# Altium schematic sheet SystemLevelDiagram.SchDoc
size E
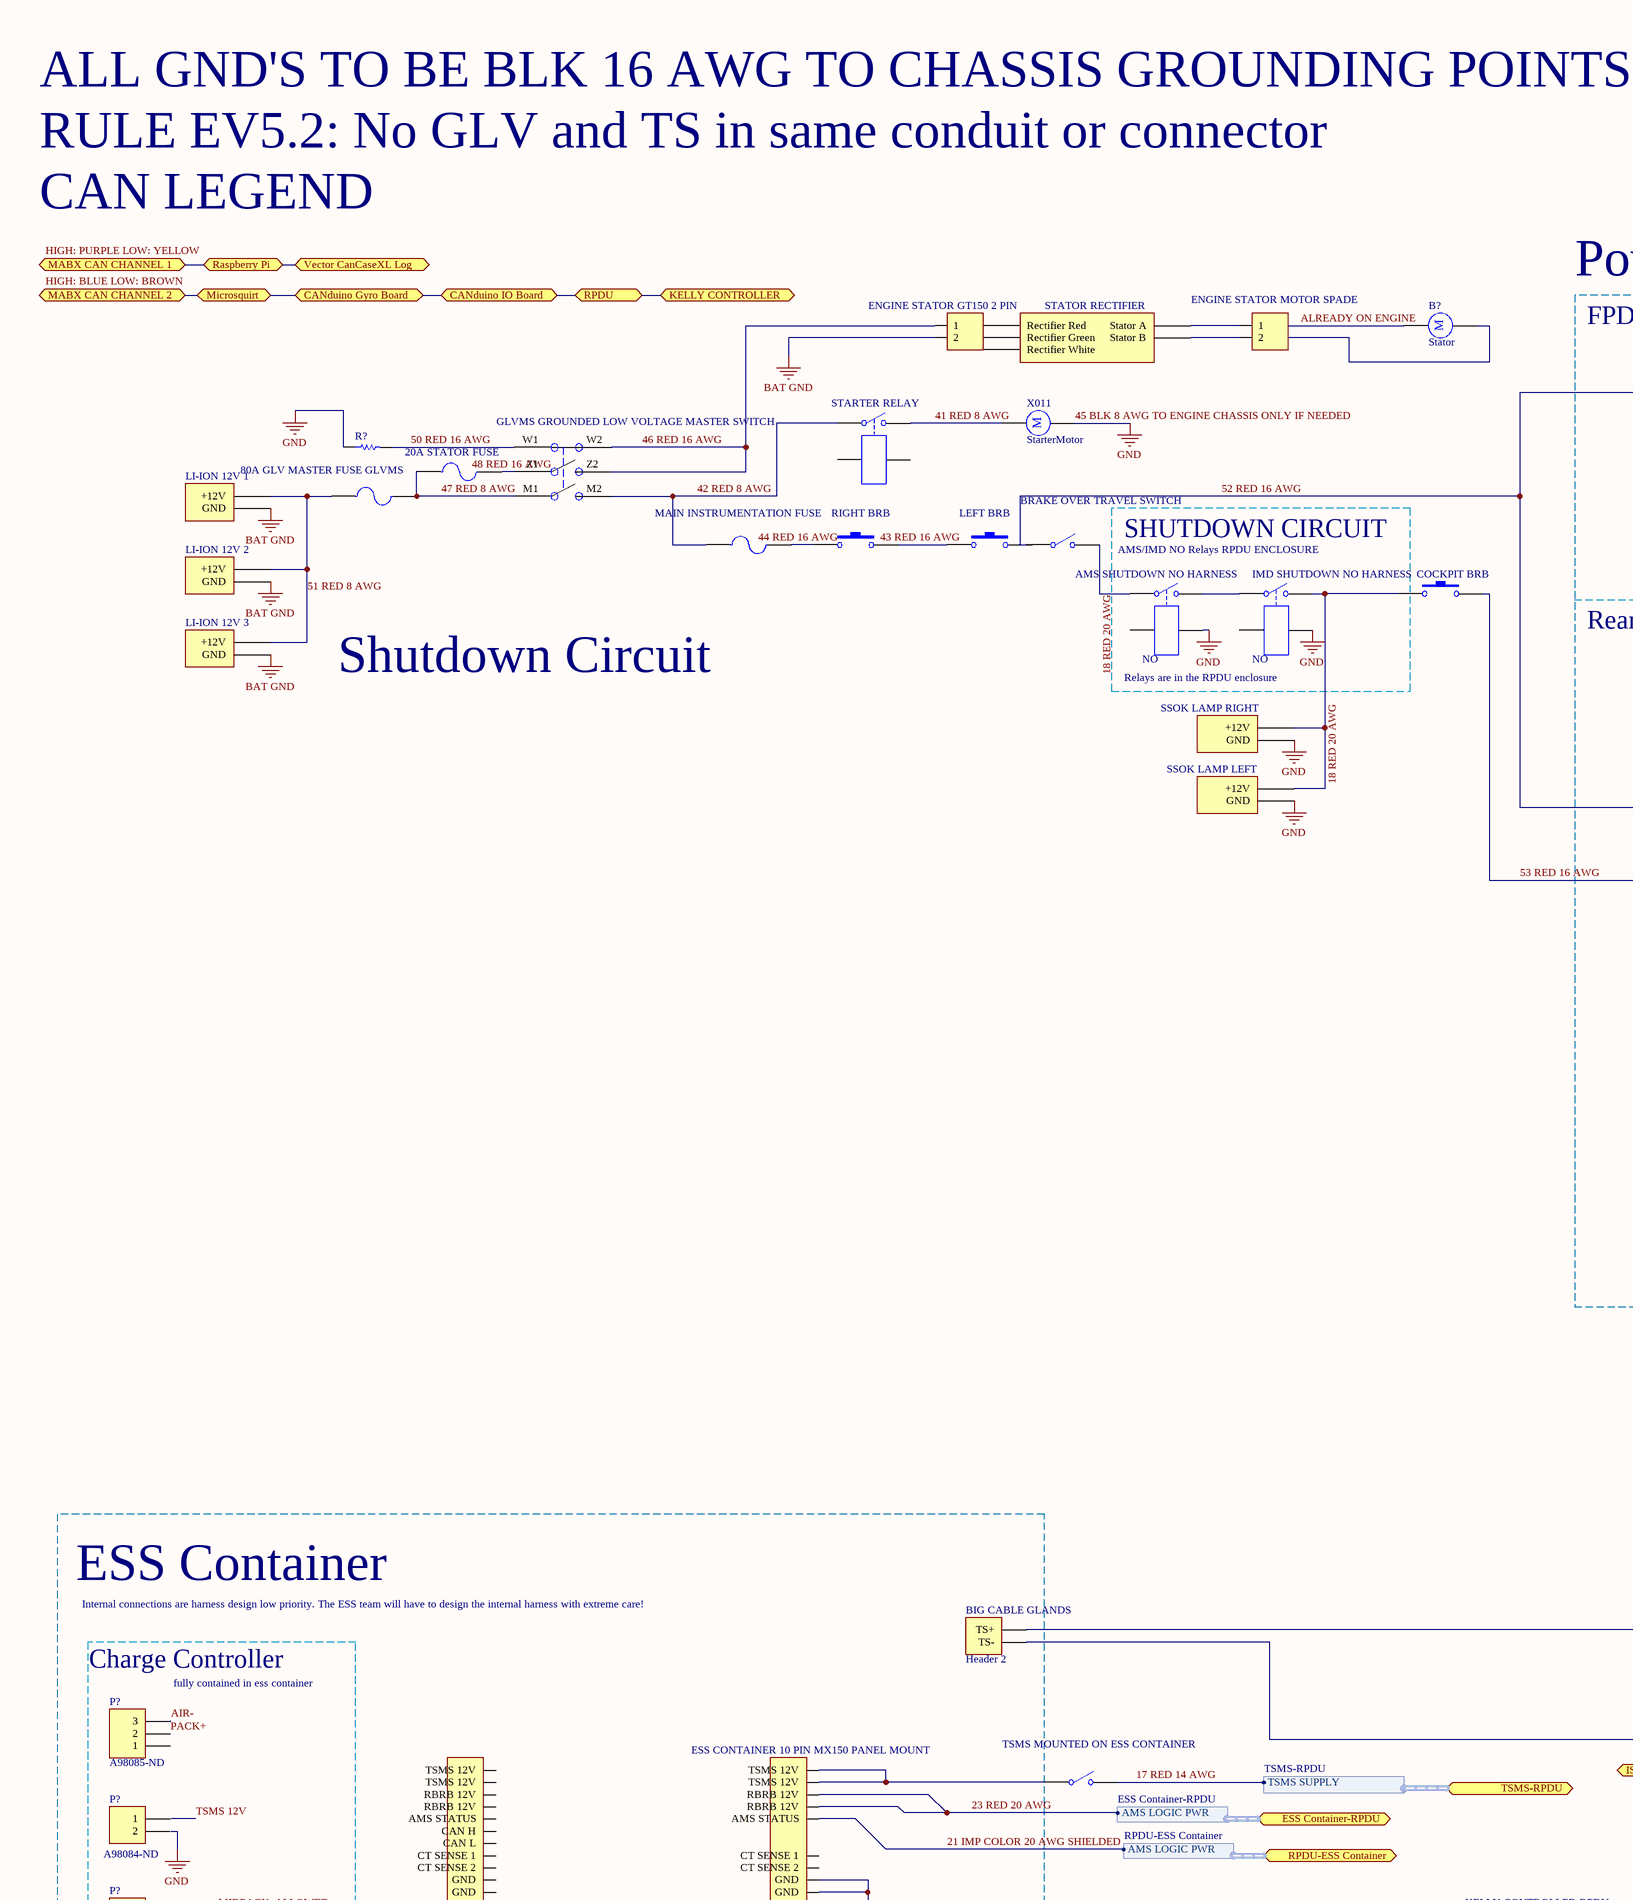
[diagram p0: SystemLevelDiagram.SchDoc, top left]
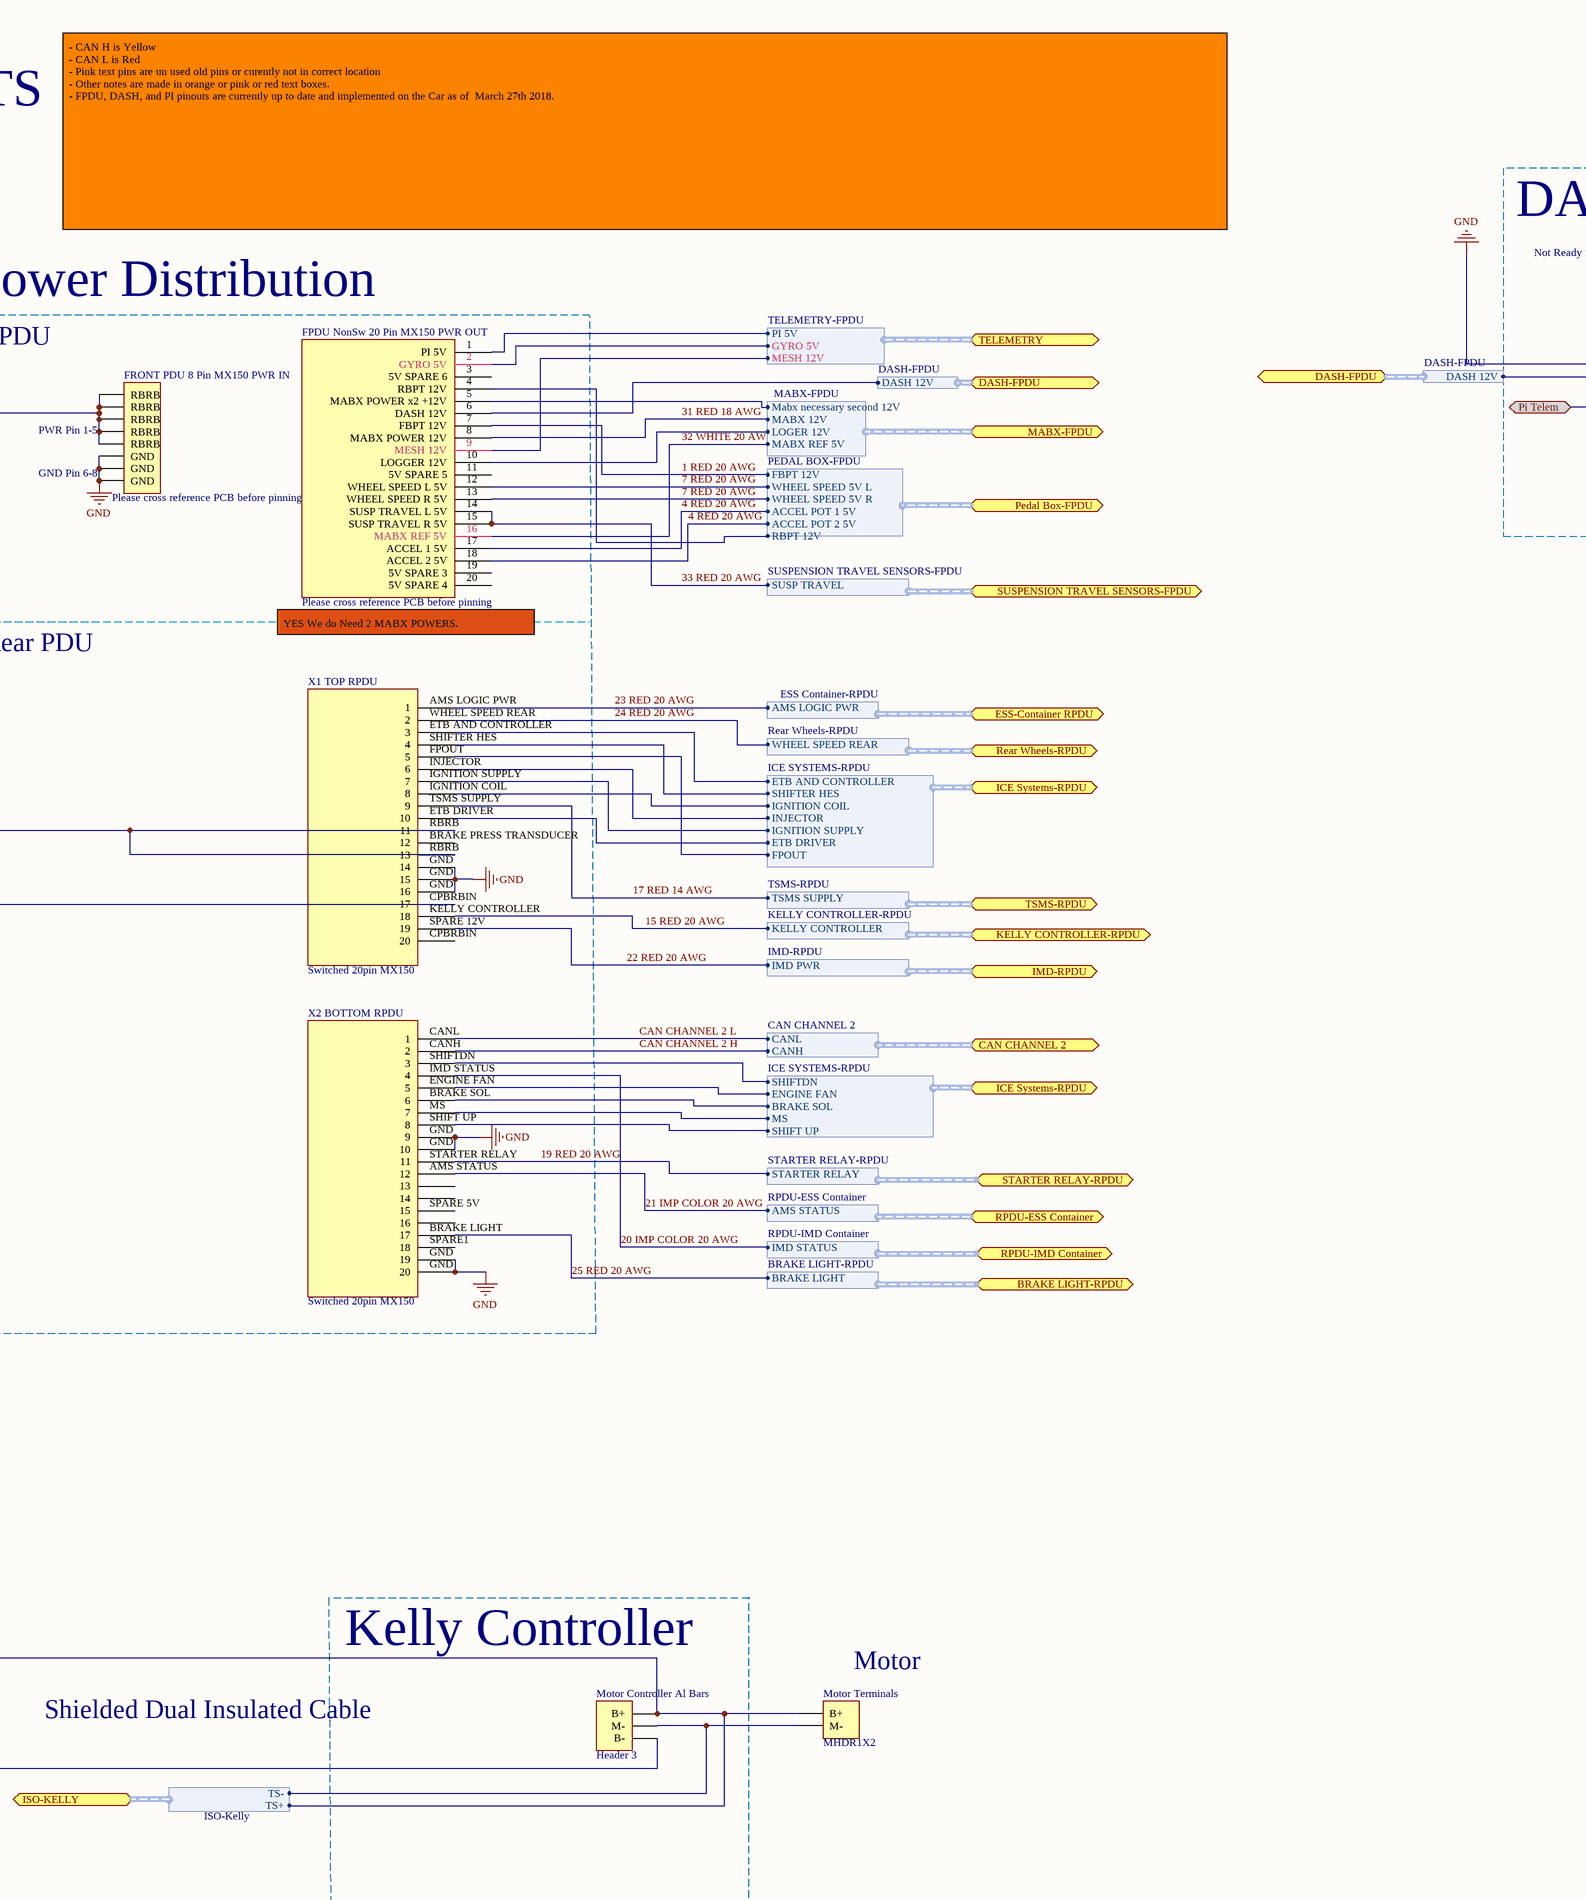
[diagram p1: SystemLevelDiagram.SchDoc, top middle]
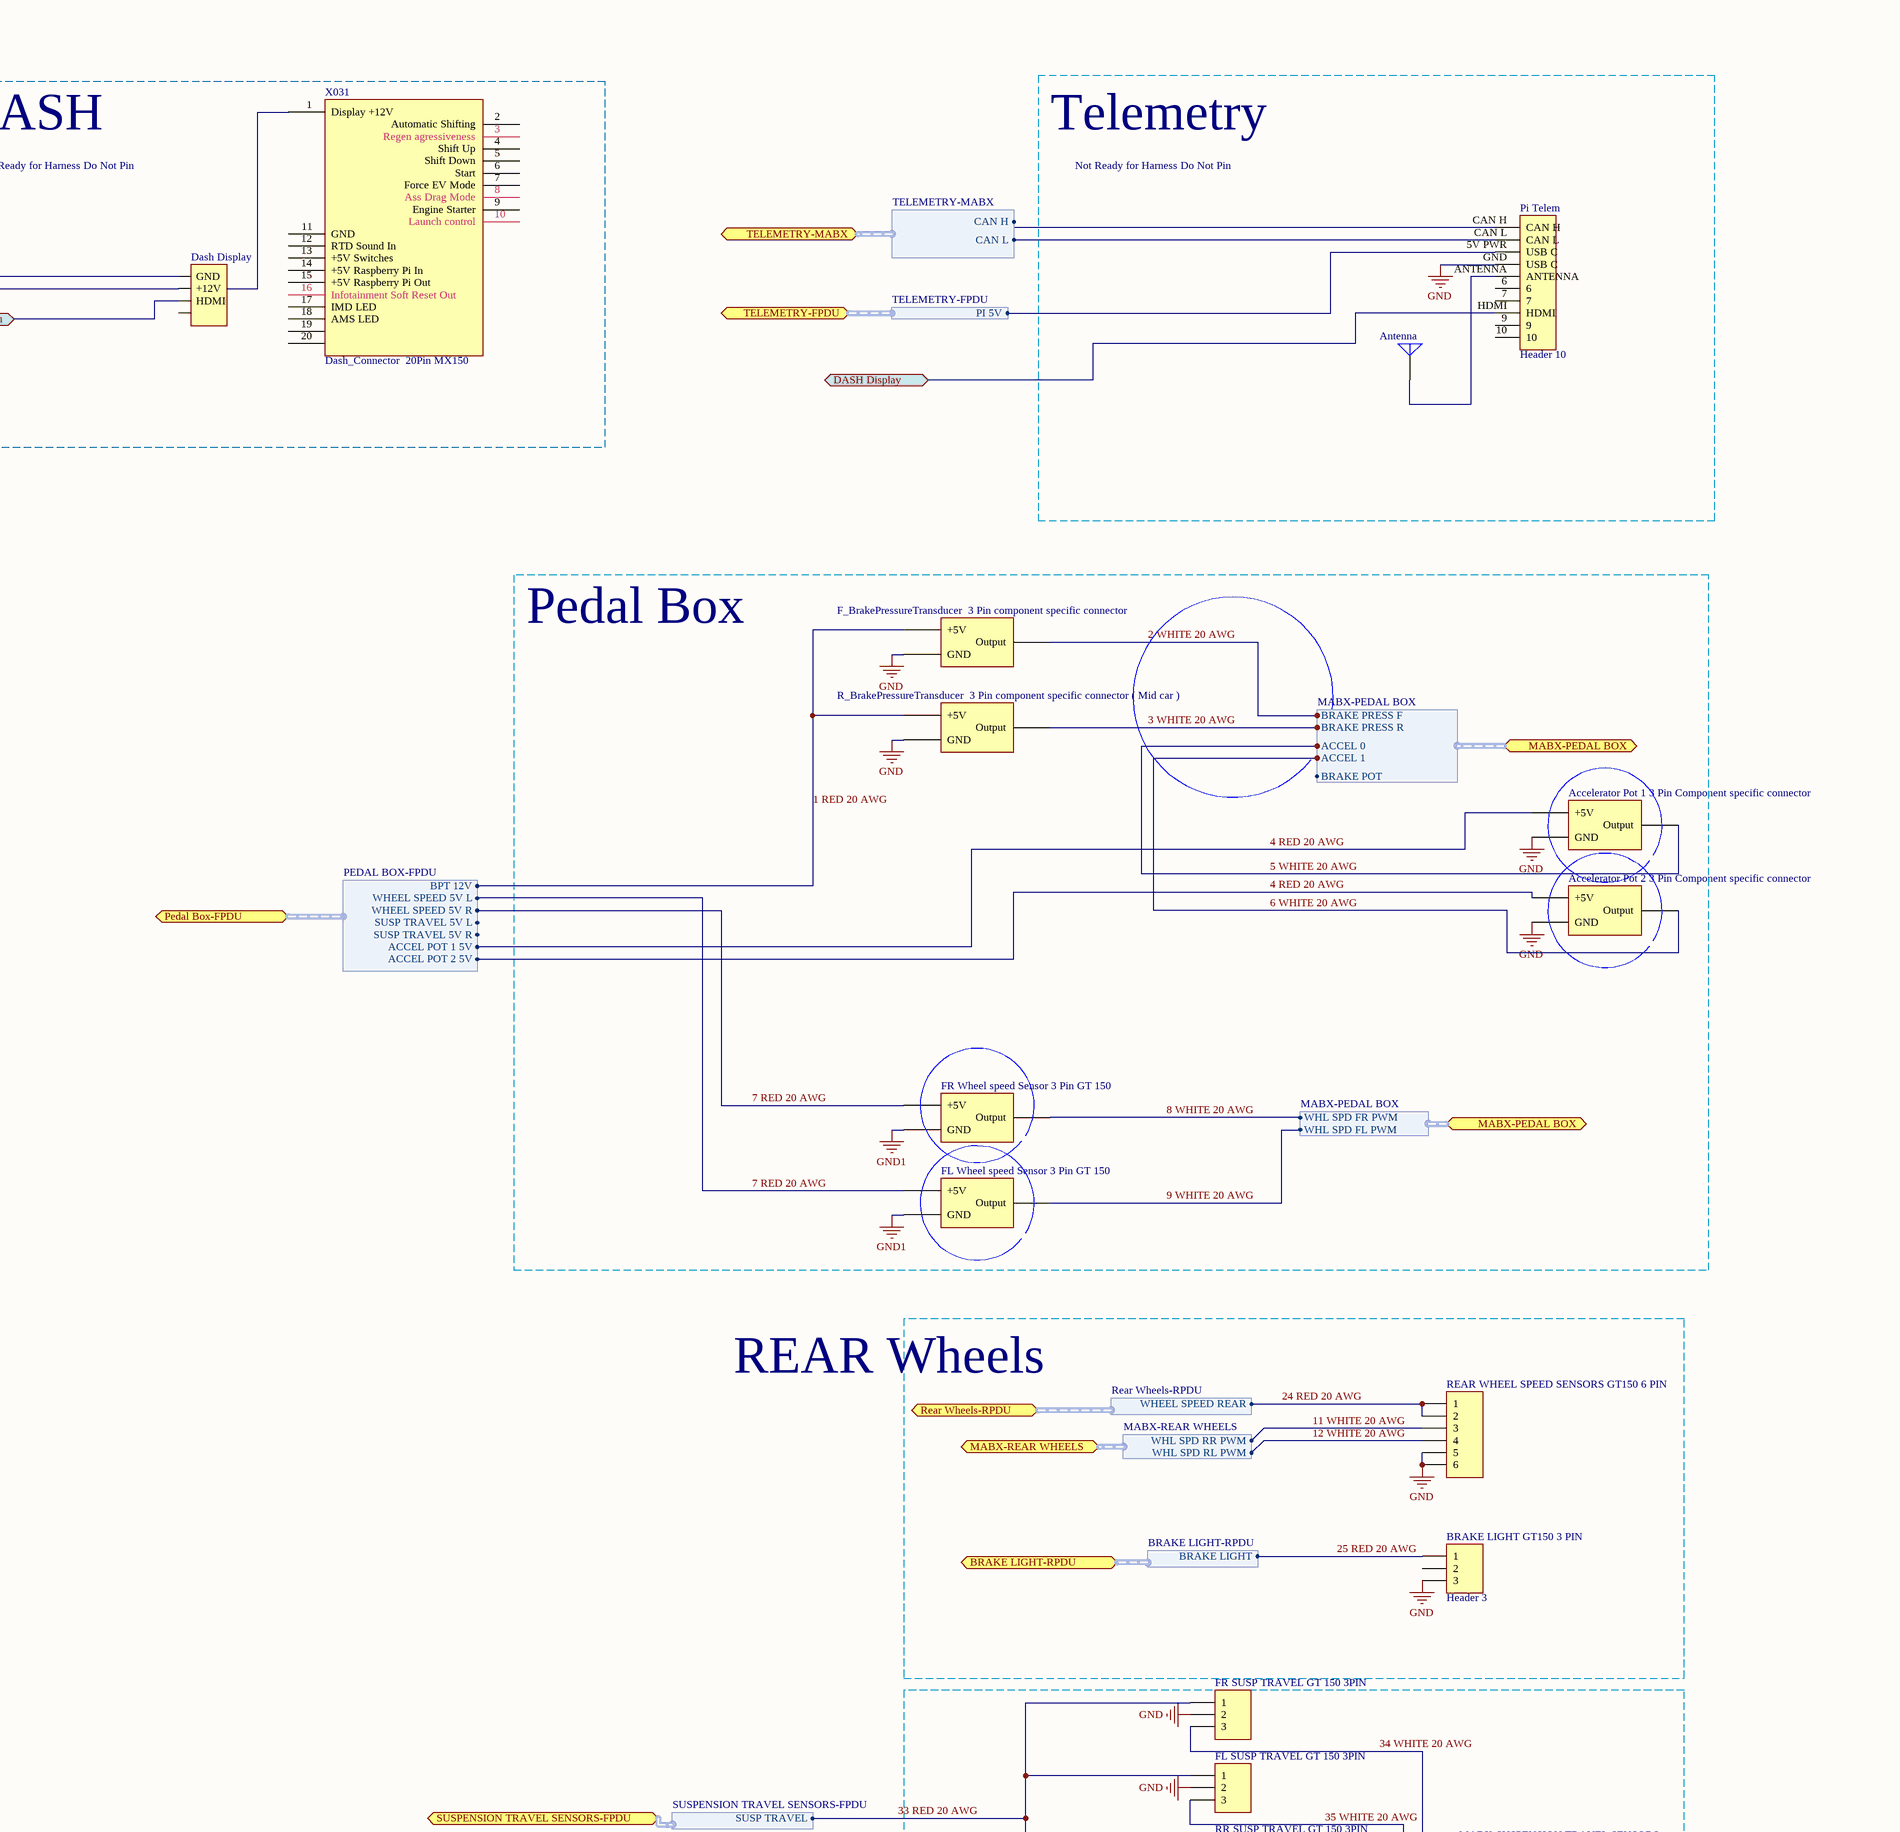
[diagram p2: SystemLevelDiagram.SchDoc, top right]
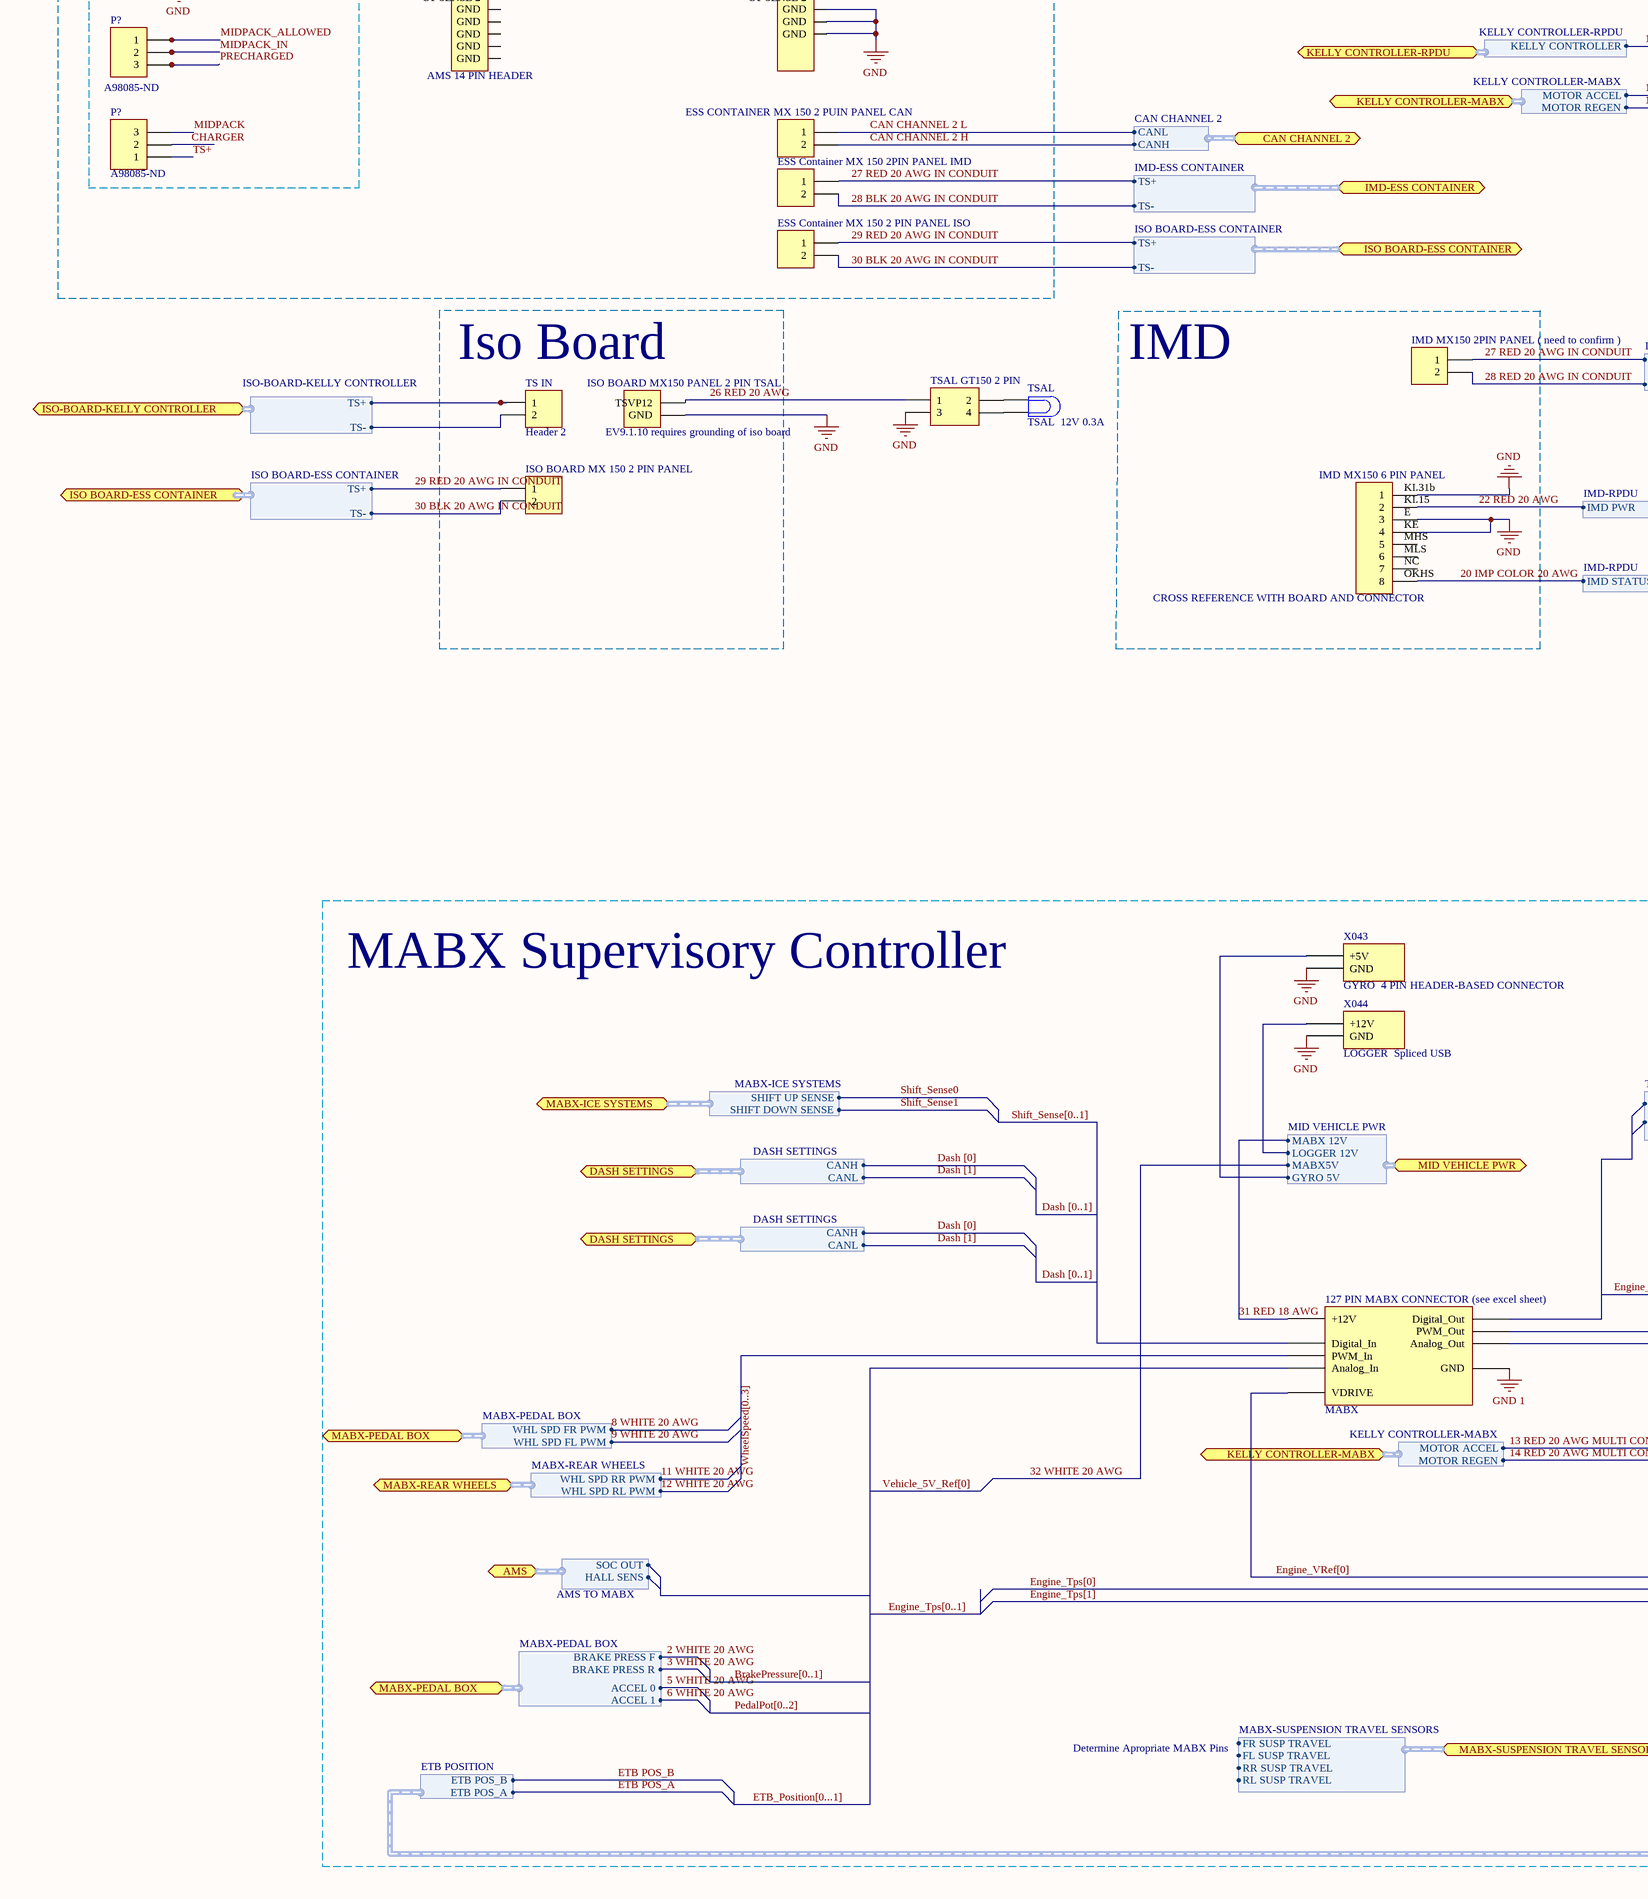
[diagram p3: SystemLevelDiagram.SchDoc, bottom left]
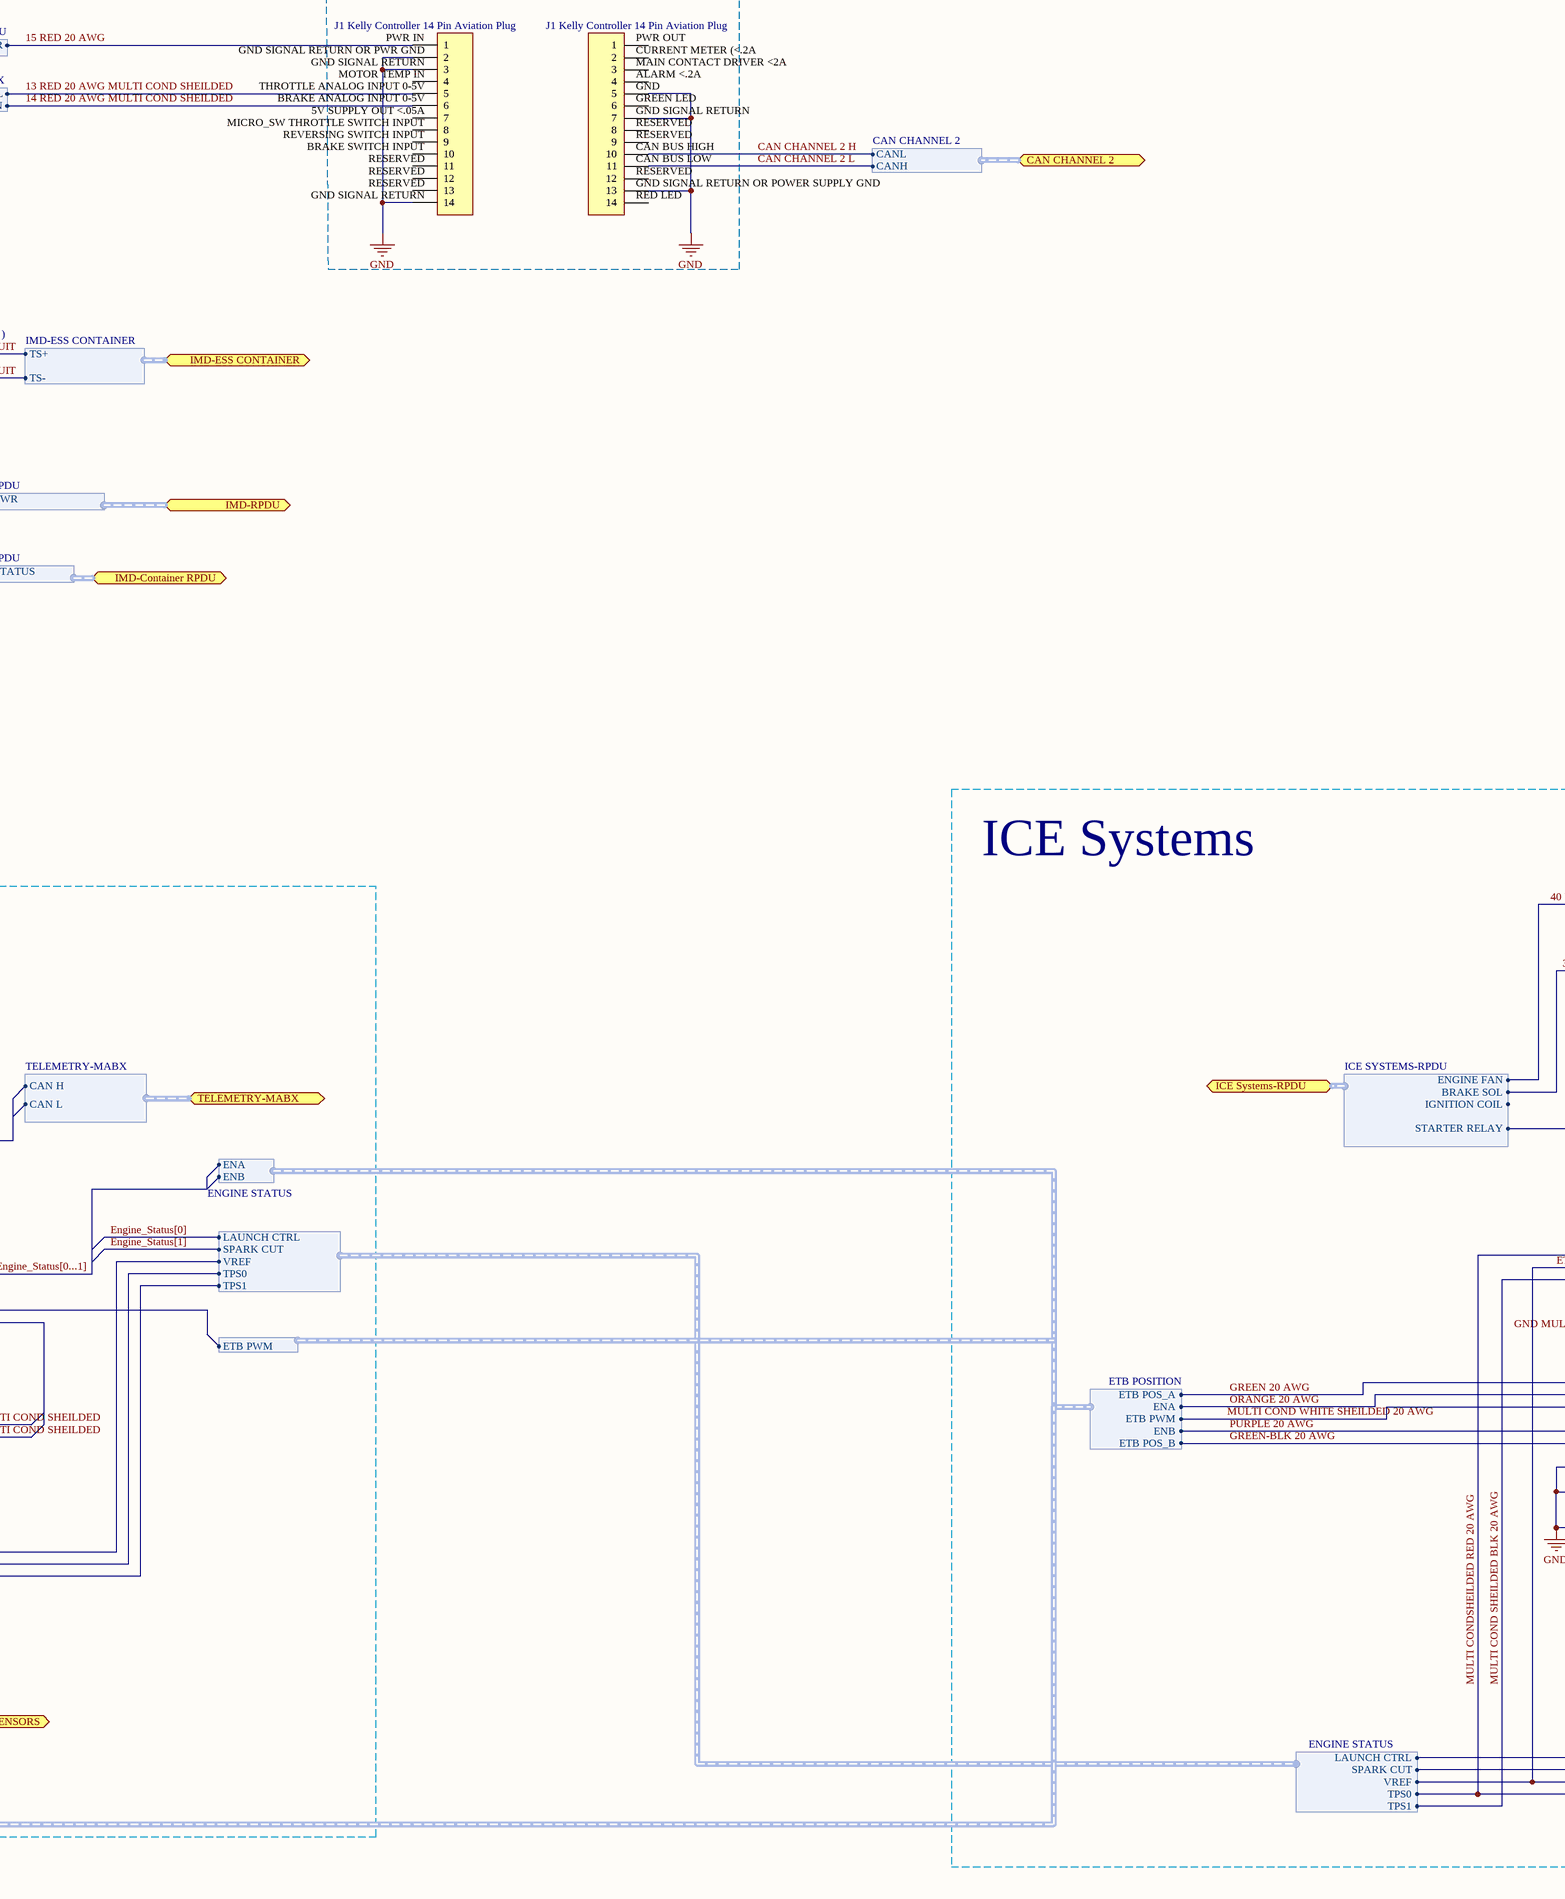
[diagram p4: SystemLevelDiagram.SchDoc, bottom middle]
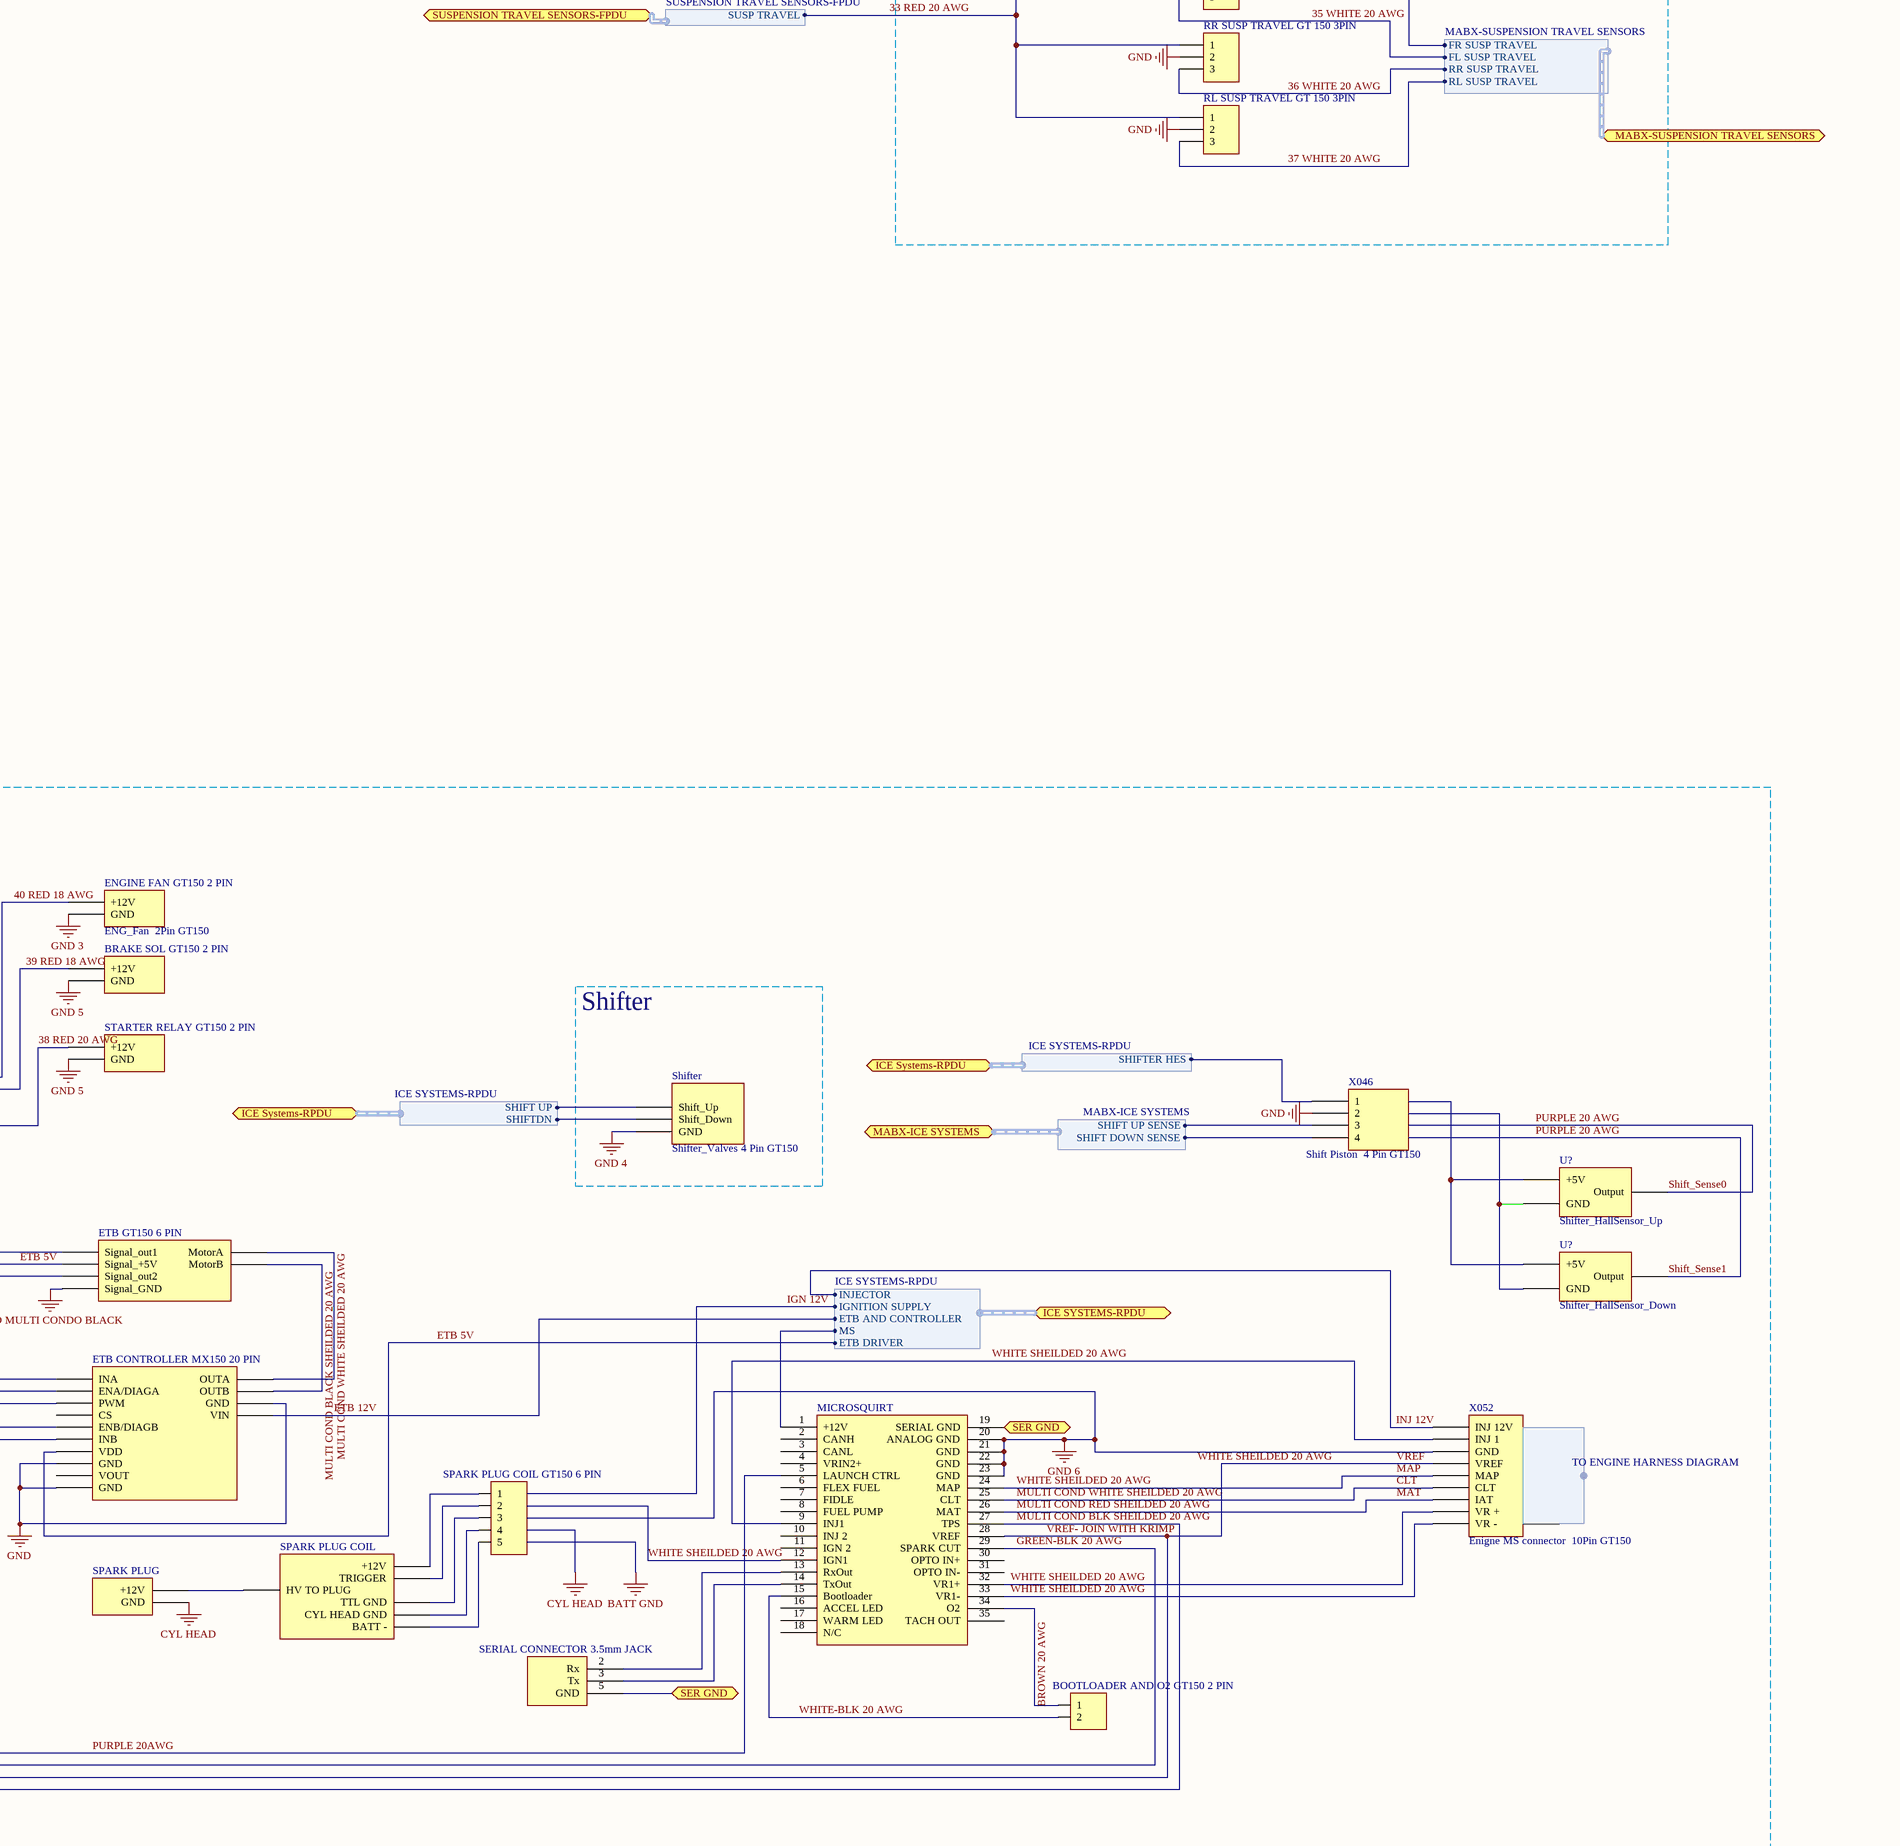
[diagram p5: SystemLevelDiagram.SchDoc, bottom right]

## Parts
(Parts that share a designator on the sheet are numbered #1, #2 ... from top to bottom, then left to right.)
20A_STATOR_FUSE  20A Stator Fuse  (value not drawn)
80A_GLV_MASTER_FUSE_GLVMS  80A GLVMasterFuse  (value not drawn)
127_PIN_MABX_CONNECTOR_(see_excel_sheet)  MABX
?  Antenna  [PIN1]
Accelerator_Pot_1_3_Pin_Component_specific_connector  Accel1Pedal_Pot  (value not drawn)
Accelerator_Pot_2_3_Pin_Component_specific_connector  Accel2Pedal_Pot  (value not drawn)
AMS_14_PIN_HEADER  14 Pin Connector  [TE Connectivity 14 Pin]  (value not drawn)
AMS_SHUTDOWN_NO_HARNESS  NO  [MODULE4]
B?  Stator  [RB5-10.5]
BIG_CABLE_GLANDS  Header 2  [HDR1X2]
BOOTLOADER_AND_O2_GT150_2_PIN  2 Pin GT150  (value not drawn)
BRAKE_LIGHT_GT150_3_PIN  Header 3  [HDR1X3]
BRAKE_OVER_TRAVEL_SWITCH  Brake Overtravel  (value not drawn)
BRAKE_SOL_GT150_2_PIN  Brake Solenoid  2Pin GT150  (value not drawn)
COCKPIT_BRB  Cockpit BRB  (value not drawn)
Dash_Display  (no value)
ENGINE_FAN_GT150_2_PIN  ENG_Fan  2Pin GT150
ENGINE_STATOR_GT150_2_PIN  2 Pin GT150  (value not drawn)
ENGINE_STATOR_MOTOR_SPADE  2x Spade  (value not drawn)
ESS_CONTAINER_10_PIN_MX150_PANEL_MOUNT  14 Pin Connector  [TE Connectivity 14 Pin]  (value not drawn)
ESS_Container_MX_150_2_PIN_PANEL_ISO  Header 2  [HDR1X2]  (value not drawn)
ESS_CONTAINER_MX_150_2_PUIN_PANEL_CAN  Header 2  [HDR1X2]  (value not drawn)
ESS_Container_MX_150_2PIN_PANEL_IMD  Header 2  [HDR1X2]  (value not drawn)
ETB_CONTROLLER_MX150_20_PIN  ETB_Controller  20Pin MX150  (value not drawn)
ETB_GT150_6_PIN  ETB  6Pin GT150  (value not drawn)
F_BrakePressureTransducer_3_Pin_component_specific_connector  F_BrakePressureTransducer  3 Pin GT150  (value not drawn)
FL_SUSP_TRAVEL_GT_150_3PIN  Header 3  [HDR1X3]  (value not drawn)
FL_Wheel_speed_Sensor_3_Pin_GT_150  FL_Wheel_Speed_Sensor  3 Pin GT150  (value not drawn)
FPDU_NonSw_20_Pin_MX150_PWR_OUT  Please cross reference PCB before pinning
FR_SUSP_TRAVEL_GT_150_3PIN  Header 3  [HDR1X3]  (value not drawn)
FR_Wheel_speed_Sensor_3_Pin_GT_150  FR_Wheel_Speed_Sensor  3 Pin GT150  (value not drawn)
FRONT_PDU_8_Pin_MX150_PWR_IN  Please cross reference PCB before pinning  [HDR1X8]
GLVMS_GROUNDED_LOW_VOLTAGE_MASTER_SWITCH  GLVMS  (value not drawn)
IMD_MX150_2PIN_PANEL_(_need_to_confirm_)  Header 2  [HDR1X2]  (value not drawn)
IMD_MX150_6_PIN_PANEL  CROSS REFERENCE WITH BOARD AND CONNECTOR  [HDR1X8]
IMD_SHUTDOWN_NO_HARNESS  NO  [MODULE4]
ISO_BOARD_MX150_PANEL_2_PIN_TSAL  Header 1  [2 Pin Screw Terminal]  (value not drawn)
ISO_BOARD_MX_150_2_PIN_PANEL  Header 2  [HDR1X2]  (value not drawn)
J1_Kelly_Controller_14_Pin_Aviation_Plug#1  Header 14  [HDR1X14]  (value not drawn)
J1_Kelly_Controller_14_Pin_Aviation_Plug#2  Header 14  [HDR1X14]  (value not drawn)
LEFT_BRB  Left BRB  (value not drawn)
LI-ION_12V_1  12V_Battery  (value not drawn)
LI-ION_12V_2  12V_Battery  (value not drawn)
LI-ION_12V_3  12V_Battery  (value not drawn)
MAIN_INSTRUMENTATION_FUSE  20A  MainLoadFuseB  (value not drawn)
MICROSQUIRT  Microsquirt  (value not drawn)
Motor_Controller_Al_Bars  Header 3  [HDR1X3]
Motor_Terminals  MHDR1X2  [MHDR1X2]
P?#1  Supplier Part Number: A98085-ND  [3 Pos wire to board]  (hidden comment: Header 3)
P?#2  Supplier Part Number: A98084-ND  [2 Pos wire to board]  (hidden comment: Header 2)
P?#3  Supplier Part Number: A98085-ND  [3 Pos wire to board]  (hidden comment: Header 3)
P?#4  Supplier Part Number: A98085-ND  [3 Pos wire to board]  (hidden comment: Header 3)
Pi_Telem  Header 10  [HDR1X10]
R?  Res1  [AXIAL-0.3]  (value not drawn)
R_BrakePressureTransducer_3_Pin_component_specific_connector_(_Mid_car_)  R_BrakePressureTransducer  3 Pin GT150  (value not drawn)
REAR_WHEEL_SPEED_SENSORS_GT150_6_PIN  Header 6  [HDR1X6]  (value not drawn)
RIGHT_BRB  Right BRB  (value not drawn)
RL_SUSP_TRAVEL_GT_150_3PIN  Header 3  [HDR1X3]  (value not drawn)
RR_SUSP_TRAVEL_GT_150_3PIN  Header 3  [HDR1X3]  (value not drawn)
SERIAL_CONNECTOR_3.5mm_JACK  Serial_Connector  (value not drawn)
Shifter  Shifter_Valves 4 Pin GT150
SPARK_PLUG  SPARK PLUG  (value not drawn)
SPARK_PLUG_COIL  Spark Plug Coil  (value not drawn)
SPARK_PLUG_COIL_GT150_6_PIN  Coil Connector  6Pin GT150  (value not drawn)
SSOK_LAMP_LEFT  SSOK Lamp Left  (value not drawn)
SSOK_LAMP_RIGHT  SSOK Lamp Right  (value not drawn)
STARTER_RELAY  Relay-SPST  [MODULE4]  (value not drawn)
STARTER_RELAY_GT150_2_PIN  Starter Relay  2Pin GT150  (value not drawn)
STATOR_RECTIFIER  Stator Rectifier  (value not drawn)
TS_IN  Header 2  [HDR1X2]
TSAL  TSAL  12V 0.3A  [PIN2]
TSAL_GT150_2_PIN  Header 2X2  [HDR2X2]  (value not drawn)
TSMS_MOUNTED_ON_ESS_CONTAINER  TSMS  (value not drawn)
U?#1  Shifter_HallSensor_Up
U?#2  Shifter_HallSensor_Down
X1_TOP_RPDU  Switched 20pin MX150
X2_BOTTOM_RPDU  Switched 20pin MX150
X011  StarterMotor
X031  Dash_Connector  20Pin MX150
X043  GYRO  4 PIN HEADER-BASED CONNECTOR
X044  LOGGER  Spliced USB
X046  Shift Piston  4 Pin GT150  [RAD-0.3]
X052  Enigne MS connector  10Pin GT150  [RAD-0.3]

## Blocks framed on the sheet
DASH: Dash_Display X031
Telemetry: ? Pi_Telem
Power Distribution: FPDU_NonSw_20_Pin_MX150_PWR_OUT FRONT_PDU_8_Pin_MX150_PWR_IN X1_TOP_RPDU X2_BOTTOM_RPDU
SHUTDOWN CIRCUIT: AMS_SHUTDOWN_NO_HARNESS IMD_SHUTDOWN_NO_HARNESS
Pedal Box: Accelerator_Pot_1_3_Pin_Component_specific_connector Accelerator_Pot_2_3_Pin_Component_specific_connector F_BrakePressureTransducer_3_Pin_component_specific_connector FL_Wheel_speed_Sensor_3_Pin_GT_150 FR_Wheel_speed_Sensor_3_Pin_GT_150 R_BrakePressureTransducer_3_Pin_component_specific_connector_(_Mid_car_)
ESS Container: AMS_14_PIN_HEADER BIG_CABLE_GLANDS ESS_CONTAINER_10_PIN_MX150_PANEL_MOUNT ESS_Container_MX_150_2_PIN_PANEL_ISO ESS_CONTAINER_MX_150_2_PUIN_PANEL_CAN ESS_Container_MX_150_2PIN_PANEL_IMD
Kelly Controller: J1_Kelly_Controller_14_Pin_Aviation_Plug#1 J1_Kelly_Controller_14_Pin_Aviation_Plug#2 Motor_Controller_Al_Bars
Charge Controller: P?#1-P?#4
Iso Board: ISO_BOARD_MX150_PANEL_2_PIN_TSAL ISO_BOARD_MX_150_2_PIN_PANEL TS_IN
IMD: IMD_MX150_2PIN_PANEL_(_need_to_confirm_) IMD_MX150_6_PIN_PANEL
ICE Systems: BOOTLOADER_AND_O2_GT150_2_PIN BRAKE_SOL_GT150_2_PIN ENGINE_FAN_GT150_2_PIN ETB_CONTROLLER_MX150_20_PIN ETB_GT150_6_PIN MICROSQUIRT SERIAL_CONNECTOR_3.5mm_JACK SPARK_PLUG SPARK_PLUG_COIL SPARK_PLUG_COIL_GT150_6_PIN STARTER_RELAY_GT150_2_PIN U?#1 U?#2 X046 X052
MABX Supervisory Controller: 127_PIN_MABX_CONNECTOR_(see_excel_sheet) X043 X044
Shifter: Shifter

## Ports
AMS (harness AMS TO MABX), BRAKE LIGHT-RPDU (harness BRAKE LIGHT-RPDU), CAN CHANNEL 2 (harness CAN CHANNEL 2), CANduino Gyro Board, CANduino IO Board, DASH Display, DASH SETTINGS (harness DASH SETTINGS), DASH-FPDU (harness DASH-FPDU), ESS Container-RPDU (harness ESS Container-RPDU), ESS-Container RPDU (harness ESS Container-RPDU), ICE SYSTEMS-RPDU (harness ICE SYSTEMS-RPDU), ICE Systems-RPDU (harness ICE SYSTEMS-RPDU), IMD-Container RPDU (harness IMD-RPDU), IMD-ESS CONTAINER (harness IMD-ESS CONTAINER), IMD-RPDU (harness IMD-RPDU), ISO BOARD-ESS CONTAINER (harness ISO BOARD-ESS CONTAINER), ISO-BOARD-KELLY CONTROLLER (harness ISO-BOARD-KELLY CONTROLLER), ISO-KELLY (harness ISO-Kelly), KELLY CONTROLLER, KELLY CONTROLLER-MABX (harness KELLY CONTROLLER-MABX), KELLY CONTROLLER-RPDU (harness KELLY CONTROLLER-RPDU), MABX CAN CHANNEL 1, MABX CAN CHANNEL 2, MABX-FPDU (harness MABX-FPDU), MABX-ICE SYSTEMS (harness MABX-ICE SYSTEMS), MABX-PEDAL BOX (harness MABX-PEDAL BOX), MABX-REAR WHEELS (harness MABX-REAR WHEELS), MABX-SUSPENSION TRAVEL SENSORS (harness MABX-SUSPENSION TRAVEL SENSORS), Microsquirt, MID VEHICLE PWR (harness MID VEHICLE PWR), Pedal Box-FPDU (harness PEDAL BOX-FPDU), Pi Telem, Raspberry Pi, Rear Wheels-RPDU (harness Rear Wheels-RPDU), RPDU, RPDU-ESS Container (harness RPDU-ESS Container), RPDU-IMD Container (harness RPDU-IMD Container), SER GND, STARTER RELAY-RPDU (harness STARTER RELAY-RPDU), SUSPENSION TRAVEL SENSORS-FPDU (harness SUSPENSION TRAVEL SENSORS-FPDU), TELEMETRY (harness TELEMETRY-FPDU), TELEMETRY-FPDU (harness TELEMETRY-FPDU), TELEMETRY-MABX (harness TELEMETRY-MABX), TSMS-RPDU (harness TSMS-RPDU), Vector CanCaseXL Log

## Harnesses
PEDAL BOX-FPDU: FBPT 12V, ACCEL POT 1 5V, ACCEL POT 2 5V, WHEEL SPEED 5V R, WHEEL SPEED 5V L, RBPT 12V
MABX-FPDU: MABX 12V, LOGER 12V, MABX REF 5V, Mabx necessary second 12V
ETB POSITION: ETB POS_A, ETB PWM, ETB POS_B, ENA, ENB
ETB POSITION: ETB POS_A, ETB POS_B
MID VEHICLE PWR: MABX 12V, LOGGER 12V, GYRO 5V, MABX5V
MABX-ICE SYSTEMS: SHIFT UP SENSE, SHIFT DOWN SENSE
MABX-REAR WHEELS: WHL SPD RR PWM, WHL SPD RL PWM
MABX-PEDAL BOX: WHL SPD FR PWM, WHL SPD FL PWM
ENGINE STATUS: LAUNCH CTRL, SPARK CUT, VREF, TPS0, TPS1
MABX-PEDAL BOX: BRAKE PRESS F, BRAKE PRESS R, ACCEL 0, ACCEL 1
ICE SYSTEMS-RPDU: INJECTOR, IGNITION SUPPLY, ETB AND CONTROLLER, MS, ETB DRIVER
DASH SETTINGS: CANH, CANL
TO ENGINE HARNESS DIAGRAM: 
AMS TO MABX: SOC OUT, HALL SENS
Harness: ENA, ENB
Harness: ETB PWM
CAN CHANNEL 2: CANH, CANL
ISO-BOARD-KELLY CONTROLLER: TS-, TS+
TELEMETRY-FPDU: PI 5V, GYRO 5V, MESH 12V
IMD-ESS CONTAINER: TS-, TS+
TELEMETRY-MABX: CAN H, CAN L
TELEMETRY-FPDU: PI 5V
DASH-FPDU: DASH 12V
ESS Container-RPDU: AMS LOGIC PWR
Rear Wheels-RPDU: WHEEL SPEED REAR
ICE SYSTEMS-RPDU: ETB AND CONTROLLER, SHIFTER HES, IGNITION COIL, INJECTOR, IGNITION SUPPLY, ETB DRIVER, FPOUT
TSMS-RPDU: TSMS SUPPLY
KELLY CONTROLLER-RPDU: KELLY CONTROLLER
CAN CHANNEL 2: CANL, CANH
ICE SYSTEMS-RPDU: SHIFTDN, ENGINE FAN, BRAKE SOL, MS, SHIFT UP
ICE SYSTEMS-RPDU: SHIFTDN, SHIFT UP
ICE SYSTEMS-RPDU: SHIFTER HES
ICE SYSTEMS-RPDU: IGNITION COIL, ENGINE FAN, BRAKE SOL, STARTER RELAY
RPDU-ESS Container: AMS STATUS
RPDU-IMD Container: IMD STATUS
IMD-RPDU: IMD STATUS
ISO-Kelly: TS-, TS+
KELLY CONTROLLER-MABX: MOTOR ACCEL, MOTOR REGEN
PEDAL BOX-FPDU: BPT 12V, ACCEL POT 1 5V, ACCEL POT 2 5V, SUSP TRAVEL 5V R, SUSP TRAVEL 5V L, WHEEL SPEED 5V R, WHEEL SPEED 5V L
MABX-PEDAL BOX: BRAKE PRESS F, BRAKE PRESS R, ACCEL 0, ACCEL 1, BRAKE POT
STARTER RELAY-RPDU: STARTER RELAY
RPDU-ESS Container: AMS LOGIC PWR
IMD-RPDU: IMD PWR
BRAKE LIGHT-RPDU: BRAKE LIGHT
ISO BOARD-ESS CONTAINER: TS-, TS+
SUSPENSION TRAVEL SENSORS-FPDU: SUSP TRAVEL
MABX-SUSPENSION TRAVEL SENSORS: FR SUSP TRAVEL, FL SUSP TRAVEL, RR SUSP TRAVEL, RL SUSP TRAVEL

## Nets
45 BLK 8 AWG TO ENGINE CHASSIS ONLY IF NEEDED: Accelerator_Pot_1_3_Pin_Component_specific_connector.3(GND) Accelerator_Pot_2_3_Pin_Component_specific_connector.3(GND) AMS_SHUTDOWN_NO_HARNESS.4 BRAKE_LIGHT_GT150_3_PIN.3 Dash_Display.1(GND) ESS_CONTAINER_10_PIN_MX150_PANEL_MOUNT.10(GND) ESS_CONTAINER_10_PIN_MX150_PANEL_MOUNT.11(GND) ESS_CONTAINER_10_PIN_MX150_PANEL_MOUNT.12(GND) ETB_CONTROLLER_MX150_20_PIN.3(GND) ETB_CONTROLLER_MX150_20_PIN.12(GND) ETB_CONTROLLER_MX150_20_PIN.14(GND) F_BrakePressureTransducer_3_Pin_component_specific_connector.2(GND) FL_SUSP_TRAVEL_GT_150_3PIN.2 FR_SUSP_TRAVEL_GT_150_3PIN.2 FRONT_PDU_8_Pin_MX150_PWR_IN.6(GND) FRONT_PDU_8_Pin_MX150_PWR_IN.7(GND) FRONT_PDU_8_Pin_MX150_PWR_IN.8(GND) IMD_MX150_6_PIN_PANEL.E(3) IMD_MX150_6_PIN_PANEL.KE(4) IMD_MX150_6_PIN_PANEL.KI.31b(1) IMD_SHUTDOWN_NO_HARNESS.4 ISO_BOARD_MX150_PANEL_2_PIN_TSAL.2(GND) J1_Kelly_Controller_14_Pin_Aviation_Plug#1.GND_SIGNAL_RETURN(3) J1_Kelly_Controller_14_Pin_Aviation_Plug#1.GND_SIGNAL_RETURN_OR_PWR_GND(2) J1_Kelly_Controller_14_Pin_Aviation_Plug#2.GND(5) J1_Kelly_Controller_14_Pin_Aviation_Plug#2.GND_SIGNAL_RETURN(7) J1_Kelly_Controller_14_Pin_Aviation_Plug#2.GND_SIGNAL_RETURN_OR_POWER_SUPPLY_GND(13) Pi_Telem.GND(USB_C) R?.1 R_BrakePressureTransducer_3_Pin_component_specific_connector_(_Mid_car_).2(GND) REAR_WHEEL_SPEED_SENSORS_GT150_6_PIN.5 REAR_WHEEL_SPEED_SENSORS_GT150_6_PIN.6 RL_SUSP_TRAVEL_GT_150_3PIN.2 RR_SUSP_TRAVEL_GT_150_3PIN.2 SSOK_LAMP_LEFT.2(GND) SSOK_LAMP_RIGHT.2(GND) TSAL_GT150_2_PIN.3 X1_TOP_RPDU.GND(14) X2_BOTTOM_RPDU.GND(9) X011.2 X043.2(GND) X044.2(GND) X046.2  [also labelled GND]
BAT GND: ENGINE_STATOR_GT150_2_PIN.2 LI-ION_12V_1.2(GND) LI-ION_12V_2.2(GND) LI-ION_12V_3.2(GND)
CYL HEAD: SPARK_PLUG.2(GND)
GND1: FL_Wheel_speed_Sensor_3_Pin_GT_150.2(GND) FR_Wheel_speed_Sensor_3_Pin_GT_150.2(GND)
GND 1: 127_PIN_MABX_CONNECTOR_(see_excel_sheet).2(GND)
GND 3: ENGINE_FAN_GT150_2_PIN.2(GND)
GND 4: Shifter.4(GND)
GND 5: BRAKE_SOL_GT150_2_PIN.2(GND) STARTER_RELAY_GT150_2_PIN.2(GND)
GND 6: MICROSQUIRT.20(ANALOG_GND) MICROSQUIRT.21(GND) MICROSQUIRT.22(GND) MICROSQUIRT.23(GND) X052.25(GND)
GND MULTI CONDO BLACK: ETB_GT150_6_PIN.4(Signal_GND)
1 RED 20 AWG: F_BrakePressureTransducer_3_Pin_component_specific_connector.1(+5V) FPDU_NonSw_20_Pin_MX150_PWR_OUT.7(FBPT_12V) R_BrakePressureTransducer_3_Pin_component_specific_connector_(_Mid_car_).1(+5V) ; port Pedal Box-FPDU.FBPT 12V, port Pedal Box-FPDU.BPT 12V
2 WHITE 20 AWG: F_BrakePressureTransducer_3_Pin_component_specific_connector.3(Output) ; port MABX-PEDAL BOX.BRAKE PRESS F
3 WHITE 20 AWG: R_BrakePressureTransducer_3_Pin_component_specific_connector_(_Mid_car_).3(Output) ; port MABX-PEDAL BOX.BRAKE PRESS R
4 RED 20 AWG: Accelerator_Pot_1_3_Pin_Component_specific_connector.1(+5V) Accelerator_Pot_2_3_Pin_Component_specific_connector.1(+5V) FPDU_NonSw_20_Pin_MX150_PWR_OUT.17(ACCEL_1_5V) FPDU_NonSw_20_Pin_MX150_PWR_OUT.18(ACCEL_2_5V) ; port Pedal Box-FPDU.ACCEL POT 1 5V, port Pedal Box-FPDU.ACCEL POT 2 5V
5 WHITE 20 AWG: Accelerator_Pot_1_3_Pin_Component_specific_connector.2(Output) ; port MABX-PEDAL BOX.ACCEL 0
6 WHITE 20 AWG: Accelerator_Pot_2_3_Pin_Component_specific_connector.2(Output) ; port MABX-PEDAL BOX.ACCEL 1
7 RED 20 AWG: FL_Wheel_speed_Sensor_3_Pin_GT_150.1(+5V) FPDU_NonSw_20_Pin_MX150_PWR_OUT.12(WHEEL_SPEED_L_5V) FPDU_NonSw_20_Pin_MX150_PWR_OUT.13(WHEEL_SPEED_R_5V) FR_Wheel_speed_Sensor_3_Pin_GT_150.1(+5V) ; port Pedal Box-FPDU.WHEEL SPEED 5V R, port Pedal Box-FPDU.WHEEL SPEED 5V L
8 WHITE 20 AWG: FR_Wheel_speed_Sensor_3_Pin_GT_150.3(Output) ; port MABX-PEDAL BOX.WHL SPD FR PWM
9 WHITE 20 AWG: FL_Wheel_speed_Sensor_3_Pin_GT_150.3(Output) ; port MABX-PEDAL BOX.WHL SPD FL PWM
11 WHITE 20 AWG: REAR_WHEEL_SPEED_SENSORS_GT150_6_PIN.3 ; port MABX-REAR WHEELS.WHL SPD RR PWM
12 WHITE 20 AWG: REAR_WHEEL_SPEED_SENSORS_GT150_6_PIN.4 ; port MABX-REAR WHEELS.WHL SPD RL PWM
13 RED 20 AWG MULTI COND SHEILDED: J1_Kelly_Controller_14_Pin_Aviation_Plug#1.THROTTLE_ANALOG_INPUT_0-5V(5) ; port KELLY CONTROLLER-MABX.MOTOR ACCEL
14 RED 20 AWG MULTI COND SHEILDED: J1_Kelly_Controller_14_Pin_Aviation_Plug#1.BRAKE_ANALOG_INPUT_0-5V(6) ; port KELLY CONTROLLER-MABX.MOTOR REGEN
15 RED 20 AWG: J1_Kelly_Controller_14_Pin_Aviation_Plug#1.PWR_IN(1) X1_TOP_RPDU.KELLY_CONTROLLER(18) ; port KELLY CONTROLLER-RPDU.KELLY CONTROLLER
17 RED 14 AWG: TSMS_MOUNTED_ON_ESS_CONTAINER.2(NO) X1_TOP_RPDU.TSMS_SUPPLY(9) ; port TSMS-RPDU.TSMS SUPPLY
18 RED 20 AWG: AMS_SHUTDOWN_NO_HARNESS.1 BRAKE_OVER_TRAVEL_SWITCH.2(NO) COCKPIT_BRB.1 IMD_SHUTDOWN_NO_HARNESS.2 SSOK_LAMP_LEFT.1(+12V) SSOK_LAMP_RIGHT.1(+12V)
19 RED 20 AWG: X2_BOTTOM_RPDU.STARTER_RELAY(11) ; port STARTER RELAY-RPDU.STARTER RELAY
20 IMP COLOR 20 AWG: IMD_MX150_6_PIN_PANEL.OKHS(8) X2_BOTTOM_RPDU.IMD_STATUS(4) ; port RPDU-IMD Container.IMD STATUS, port IMD-Container RPDU.IMD STATUS
21 IMP COLOR 20 AWG: X2_BOTTOM_RPDU.AMS_STATUS(12) ; port RPDU-ESS Container.AMS STATUS
21 IMP COLOR 20 AWG SHIELDED: ESS_CONTAINER_10_PIN_MX150_PANEL_MOUNT.5(AMS_STATUS) ; port RPDU-ESS Container.AMS LOGIC PWR
22 RED 20 AWG: IMD_MX150_6_PIN_PANEL.KI.15(2) X1_TOP_RPDU.SPARE_12V(19) ; port IMD-RPDU.IMD PWR
23 RED 20 AWG: ESS_CONTAINER_10_PIN_MX150_PANEL_MOUNT.3(RBRB_12V) ESS_CONTAINER_10_PIN_MX150_PANEL_MOUNT.4(RBRB_12V) X1_TOP_RPDU.AMS_LOGIC_PWR(1) ; port ESS-Container RPDU.AMS LOGIC PWR, port ESS Container-RPDU.AMS LOGIC PWR
24 RED 20 AWG: REAR_WHEEL_SPEED_SENSORS_GT150_6_PIN.1 REAR_WHEEL_SPEED_SENSORS_GT150_6_PIN.2 X1_TOP_RPDU.WHEEL_SPEED_REAR(2) ; port Rear Wheels-RPDU.WHEEL SPEED REAR
25 RED 20 AWG: BRAKE_LIGHT_GT150_3_PIN.1 X2_BOTTOM_RPDU.BRAKE_LIGHT(17) ; port BRAKE LIGHT-RPDU.BRAKE LIGHT
26 RED 20 AWG: ISO_BOARD_MX150_PANEL_2_PIN_TSAL.1(TSVP12) TSAL_GT150_2_PIN.1
27 RED 20 AWG IN CONDUIT: ESS_Container_MX_150_2PIN_PANEL_IMD.1 IMD_MX150_2PIN_PANEL_(_need_to_confirm_).1 ; port IMD-ESS CONTAINER.TS+
28 BLK 20 AWG IN CONDUIT: ESS_Container_MX_150_2PIN_PANEL_IMD.2 IMD_MX150_2PIN_PANEL_(_need_to_confirm_).2 ; port IMD-ESS CONTAINER.TS-  [also labelled 28 RED 20 AWG IN CONDUIT]
29 RED 20 AWG IN CONDUIT: ESS_Container_MX_150_2_PIN_PANEL_ISO.1 ISO_BOARD_MX_150_2_PIN_PANEL.1 ; port ISO BOARD-ESS CONTAINER.TS+
30 BLK 20 AWG IN CONDUIT: ESS_Container_MX_150_2_PIN_PANEL_ISO.2 ISO_BOARD_MX_150_2_PIN_PANEL.2 ; port ISO BOARD-ESS CONTAINER.TS-
31 RED 18 AWG: 127_PIN_MABX_CONNECTOR_(see_excel_sheet).1(+12V) FPDU_NonSw_20_Pin_MX150_PWR_OUT.8(MABX_POWER_12V) ; port MABX-FPDU.MABX 12V, port MID VEHICLE PWR.MABX 12V
32 WHITE 20 AWG: FPDU_NonSw_20_Pin_MX150_PWR_OUT.16(MABX_REF_5V) ; port MABX-FPDU.MABX REF 5V, port MID VEHICLE PWR.MABX5V
33 RED 20 AWG: FL_SUSP_TRAVEL_GT_150_3PIN.1 FPDU_NonSw_20_Pin_MX150_PWR_OUT.14(SUSP_TRAVEL_L_5V) FPDU_NonSw_20_Pin_MX150_PWR_OUT.15(SUSP_TRAVEL_R_5V) FR_SUSP_TRAVEL_GT_150_3PIN.1 RL_SUSP_TRAVEL_GT_150_3PIN.1 RR_SUSP_TRAVEL_GT_150_3PIN.1 ; port SUSPENSION TRAVEL SENSORS-FPDU.SUSP TRAVEL
34 WHITE 20 AWG: FR_SUSP_TRAVEL_GT_150_3PIN.3 ; port MABX-SUSPENSION TRAVEL SENSORS.FR SUSP TRAVEL
35 WHITE 20 AWG: FL_SUSP_TRAVEL_GT_150_3PIN.3 ; port MABX-SUSPENSION TRAVEL SENSORS.FL SUSP TRAVEL
36 WHITE 20 AWG: RR_SUSP_TRAVEL_GT_150_3PIN.3 ; port MABX-SUSPENSION TRAVEL SENSORS.RR SUSP TRAVEL
37 WHITE 20 AWG: RL_SUSP_TRAVEL_GT_150_3PIN.3 ; port MABX-SUSPENSION TRAVEL SENSORS.RL SUSP TRAVEL
38 RED 20 AWG: STARTER_RELAY_GT150_2_PIN.1(+12V) ; port ICE SYSTEMS-RPDU.STARTER RELAY
39 RED 18 AWG: BRAKE_SOL_GT150_2_PIN.1(+12V) X2_BOTTOM_RPDU.BRAKE_SOL(6) ; port ICE SYSTEMS-RPDU.BRAKE SOL
40 RED 18 AWG: ENGINE_FAN_GT150_2_PIN.1(+12V) X2_BOTTOM_RPDU.ENGINE_FAN(5) ; port ICE SYSTEMS-RPDU.ENGINE FAN
41 RED 8 AWG: STARTER_RELAY.2 X011.1
42 RED 8 AWG: GLVMS_GROUNDED_LOW_VOLTAGE_MASTER_SWITCH.M2 MAIN_INSTRUMENTATION_FUSE.1 STARTER_RELAY.1
46 RED 16 AWG: ENGINE_STATOR_GT150_2_PIN.1 GLVMS_GROUNDED_LOW_VOLTAGE_MASTER_SWITCH.W2 GLVMS_GROUNDED_LOW_VOLTAGE_MASTER_SWITCH.Z2
47 RED 8 AWG: 20A_STATOR_FUSE.1 80A_GLV_MASTER_FUSE_GLVMS.2 GLVMS_GROUNDED_LOW_VOLTAGE_MASTER_SWITCH.M1
50 RED 16 AWG: GLVMS_GROUNDED_LOW_VOLTAGE_MASTER_SWITCH.W1 R?.2
51 RED 8 AWG: 80A_GLV_MASTER_FUSE_GLVMS.1 LI-ION_12V_1.1(+12V) LI-ION_12V_2.1(+12V) LI-ION_12V_3.1(+12V)
52 RED 16 AWG: BRAKE_OVER_TRAVEL_SWITCH.1(COMMON) FRONT_PDU_8_Pin_MX150_PWR_IN.1(RBRB) FRONT_PDU_8_Pin_MX150_PWR_IN.2(RBRB) FRONT_PDU_8_Pin_MX150_PWR_IN.3(RBRB) FRONT_PDU_8_Pin_MX150_PWR_IN.4(RBRB) FRONT_PDU_8_Pin_MX150_PWR_IN.5(RBRB) X1_TOP_RPDU.RBRB(11)
53 RED 16 AWG: COCKPIT_BRB.2 X1_TOP_RPDU.CPBRBIN(17)
AIR-: P?#1.3
ALREADY ON ENGINE: B?.1
BROWN 20 AWG: BOOTLOADER_AND_O2_GT150_2_PIN.1 MICROSQUIRT.34(O2)
CAN CHANNEL 2 H: ESS_CONTAINER_MX_150_2_PUIN_PANEL_CAN.1 ESS_CONTAINER_MX_150_2_PUIN_PANEL_CAN.2 J1_Kelly_Controller_14_Pin_Aviation_Plug#2.CAN_BUS_HIGH(10) J1_Kelly_Controller_14_Pin_Aviation_Plug#2.CAN_BUS_LOW(11) X2_BOTTOM_RPDU.CANH(2) X2_BOTTOM_RPDU.CANL(1) ; port CAN CHANNEL 2.CANH, port CAN CHANNEL 2.CANL  [also labelled CAN CHANNEL 2 L]
CANduino Gyro Board: port Microsquirt, port CANduino Gyro Board, port CANduino IO Board, port MABX CAN CHANNEL 2, port RPDU, port KELLY CONTROLLER
CHARGER: P?#4.2
CLT: ETB_CONTROLLER_MX150_20_PIN.1(OUTA) ETB_CONTROLLER_MX150_20_PIN.7(PWM) ETB_GT150_6_PIN.5(MotorA) MICROSQUIRT.25(CLT) X052.3(CLT) ; harness ETB POSITION.ETB PWM, harness Harness.ETB PWM  [also labelled MULTI COND WHITE SHEILDED 20 AWG]
Dash [0]: port DASH SETTINGS.CANH
Dash [1]: port DASH SETTINGS.CANL
DASH Display: Pi_Telem.HDMI ; port DASH Display
Engine_Status[0]: MICROSQUIRT.5(LAUNCH_CTRL) ; harness ENGINE STATUS.LAUNCH CTRL  [also labelled PURPLE 20AWG]
Engine_Status[1]: ETB_CONTROLLER_MX150_20_PIN.10(INB) MICROSQUIRT.29(SPARK_CUT) ; harness ETB POSITION.ETB POS_B, harness ENGINE STATUS.SPARK CUT  [also labelled ETB POS_B, GREEN-BLK 20 AWG]
Engine_Tps[0]: ETB_GT150_6_PIN.1(Signal_out1) MICROSQUIRT.27(TPS) ; harness ENGINE STATUS.TPS0  [also labelled MULTI COND BLK SHEILDED 20 AWG, MULTI CONDSHEILDED RED 20 AWG]
Engine_Tps[1]: ETB_GT150_6_PIN.3(Signal_out2) ; harness ENGINE STATUS.TPS1  [also labelled MULTI COND SHEILDED BLK 20 AWG]
Engine_VRef[0]: 127_PIN_MABX_CONNECTOR_(see_excel_sheet).6(VDRIVE) ETB_CONTROLLER_MX150_20_PIN.11(VDD) ETB_GT150_6_PIN.2(Signal_+5V) MICROSQUIRT.28(VREF) X1_TOP_RPDU.ETB_DRIVER(10) X052.7(VREF) ; harness ENGINE STATUS.VREF, port ICE SYSTEMS-RPDU.ETB DRIVER  [also labelled ETB 5V, VREF, VREF- JOIN WITH KRIMP]
ETB 12V: ETB_CONTROLLER_MX150_20_PIN.4(VIN) X1_TOP_RPDU.ETB_AND_CONTROLLER(3) ; port ICE SYSTEMS-RPDU.ETB AND CONTROLLER
ETB POS_A: ETB_CONTROLLER_MX150_20_PIN.5(INA) ; harness ETB POSITION.ETB POS_A  [also labelled GREEN 20 AWG]
IGN 12V: X1_TOP_RPDU.IGNITION_SUPPLY(7) ; port ICE SYSTEMS-RPDU.IGNITION SUPPLY
INJ 12V: X1_TOP_RPDU.INJECTOR(6) X052.22(INJ_12V) ; port ICE SYSTEMS-RPDU.INJECTOR
MABX CAN CHANNEL 1: port Raspberry Pi, port Vector CanCaseXL Log, port MABX CAN CHANNEL 1
MAP: MICROSQUIRT.9(INJ1) MICROSQUIRT.12(IGN1) MICROSQUIRT.24(MAP) MICROSQUIRT.32(VR1+) MICROSQUIRT.33(VR1-) X052.1(VR_+) X052.2(VR_-) X052.5(MAP) X052.8(INJ_1)  [also labelled WHITE SHEILDED 20 AWG]
MAT: MICROSQUIRT.26(MAT) X052.4(IAT)  [also labelled MULTI COND RED SHEILDED 20 AWG]
MIDPACK: P?#4.3
MIDPACK_ALLOWED: P?#3.1
MIDPACK_IN: P?#3.2
MULTI COND BLACK SHEILDED 20 AWG: ETB_CONTROLLER_MX150_20_PIN.2(OUTB) ETB_GT150_6_PIN.6(MotorB)
ORANGE 20 AWG: ETB_CONTROLLER_MX150_20_PIN.6(ENA/DIAGA) ; harness ETB POSITION.ENA, harness Harness.ENA
PACK+: P?#1.2
Pi Telem: Dash_Display.3(HDMI) ; port Pi Telem
PRECHARGED: P?#3.3
PURPLE 20 AWG: ETB_CONTROLLER_MX150_20_PIN.9(ENB/DIAGB) U?#1.2(Output) U?#2.2(Output) X046.3 X046.4 ; harness ETB POSITION.ENB, port MABX-ICE SYSTEMS.SHIFT UP SENSE, port MABX-ICE SYSTEMS.SHIFT DOWN SENSE, harness Harness.ENB  [also labelled Shift_Sense0, Shift_Sense1]  [project net Dash 0]
SER GND: MICROSQUIRT.19(SERIAL_GND) SERIAL_CONNECTOR_3.5mm_JACK.5(GND) ; port SER GND
TS+: P?#4.1
WHITE-BLK 20 AWG: BOOTLOADER_AND_O2_GT150_2_PIN.2 MICROSQUIRT.15(Bootloader)
Net20A_STATOR_FUSE_2: 20A_STATOR_FUSE.2 GLVMS_GROUNDED_LOW_VOLTAGE_MASTER_SWITCH.Z1
Net?_1: ?.1(A) Pi_Telem.ANTENNA
NetAMS_SHUTDOWN_NO_HARNESS_2: AMS_SHUTDOWN_NO_HARNESS.2 IMD_SHUTDOWN_NO_HARNESS.1
NetBIG_CABLE_GLANDS_1: BIG_CABLE_GLANDS.1(TS+) Motor_Controller_Al_Bars.1(B+) Motor_Terminals.B+ ; port ISO-KELLY.TS+
NetBIG_CABLE_GLANDS_2: BIG_CABLE_GLANDS.2(TS-) Motor_Controller_Al_Bars.3(B-)
NetDash_Display_2: Dash_Display.2(+12V) FPDU_NonSw_20_Pin_MX150_PWR_OUT.6(DASH_12V) ; port DASH-FPDU.DASH 12V
NetENGINE_STATOR_MOTOR_SPADE_1: ENGINE_STATOR_MOTOR_SPADE.1 STATOR_RECTIFIER.7(Stator_A)
NetENGINE_STATOR_MOTOR_SPADE_2: ENGINE_STATOR_MOTOR_SPADE.2 STATOR_RECTIFIER.8(Stator_B)
NetESS_CONTAINER_10_PIN_MX150_PANEL_MOUNT_1: ESS_CONTAINER_10_PIN_MX150_PANEL_MOUNT.1(TSMS_12V) ESS_CONTAINER_10_PIN_MX150_PANEL_MOUNT.2(TSMS_12V) TSMS_MOUNTED_ON_ESS_CONTAINER.1(COMMON)
NetFPDU_NonSw_20_Pin_MX150_PWR_OUT_1: FPDU_NonSw_20_Pin_MX150_PWR_OUT.1(PI_5V) ; port TELEMETRY.PI 5V
NetFPDU_NonSw_20_Pin_MX150_PWR_OUT_2: FPDU_NonSw_20_Pin_MX150_PWR_OUT.2(GYRO_5V) ; port TELEMETRY.GYRO 5V
NetFPDU_NonSw_20_Pin_MX150_PWR_OUT_4: FPDU_NonSw_20_Pin_MX150_PWR_OUT.4(RBPT_12V) ; port Pedal Box-FPDU.RBPT 12V
NetFPDU_NonSw_20_Pin_MX150_PWR_OUT_5: FPDU_NonSw_20_Pin_MX150_PWR_OUT.5(MABX_POWER_x2_+12V) ; port MABX-FPDU.Mabx necessary second 12V
NetFPDU_NonSw_20_Pin_MX150_PWR_OUT_9: FPDU_NonSw_20_Pin_MX150_PWR_OUT.9(MESH_12V) ; port TELEMETRY.MESH 12V
NetFPDU_NonSw_20_Pin_MX150_PWR_OUT_10: FPDU_NonSw_20_Pin_MX150_PWR_OUT.10(LOGGER_12V) ; port MABX-FPDU.LOGER 12V
NetLEFT_BRB_1: LEFT_BRB.1 RIGHT_BRB.2
NetMAIN_INSTRUMENTATION_FUSE_2: MAIN_INSTRUMENTATION_FUSE.2 RIGHT_BRB.1
NetMICROSQUIRT_1: MICROSQUIRT.1(+12V) X2_BOTTOM_RPDU.MS(7) ; port ICE SYSTEMS-RPDU.MS
NetMICROSQUIRT_13: MICROSQUIRT.13(RxOut) SERIAL_CONNECTOR_3.5mm_JACK.2(Rx)
NetMICROSQUIRT_14: MICROSQUIRT.14(TxOut) SERIAL_CONNECTOR_3.5mm_JACK.3(Tx)
NetMotor_Controller_Al_Bars_2: Motor_Controller_Al_Bars.2(M-) Motor_Terminals.M- ; port ISO-KELLY.TS-
NetPi_Telem_5V PWR: Pi_Telem.5V_PWR(USB_C) ; port TELEMETRY-FPDU.PI 5V
NetPi_Telem_CAN H: Pi_Telem.CAN_H ; port TELEMETRY-MABX.CAN H
NetPi_Telem_CAN L: Pi_Telem.CAN_L ; port TELEMETRY-MABX.CAN L
NetShifter_2: Shifter.2(Shift_Down) X2_BOTTOM_RPDU.SHIFTDN(3) ; port ICE SYSTEMS-RPDU.SHIFTDN
NetShifter_5: Shifter.5(Shift_Up) X2_BOTTOM_RPDU.SHIFT_UP(8) ; port ICE SYSTEMS-RPDU.SHIFT UP
NetSPARK_PLUG_1: SPARK_PLUG.1(+12V) SPARK_PLUG_COIL.3(HV_TO_PLUG)
NetSPARK_PLUG_COIL_1: SPARK_PLUG_COIL.1(+12V) SPARK_PLUG_COIL_GT150_6_PIN.1
NetSPARK_PLUG_COIL_2: SPARK_PLUG_COIL.2(TTL_GND) SPARK_PLUG_COIL_GT150_6_PIN.3
NetSPARK_PLUG_COIL_4: SPARK_PLUG_COIL.4(BATT_-) SPARK_PLUG_COIL_GT150_6_PIN.5
NetSPARK_PLUG_COIL_5: SPARK_PLUG_COIL.5(TRIGGER) SPARK_PLUG_COIL_GT150_6_PIN.2
NetSPARK_PLUG_COIL_6: SPARK_PLUG_COIL.6(CYL_HEAD_GND) SPARK_PLUG_COIL_GT150_6_PIN.4
NetTS_IN_1: TS_IN.1 ; port ISO-BOARD-KELLY CONTROLLER.TS+
NetTS_IN_2: TS_IN.2 ; port ISO-BOARD-KELLY CONTROLLER.TS-
NetTSAL_1: TSAL.1 TSAL_GT150_2_PIN.2
NetTSAL_2: TSAL.2 TSAL_GT150_2_PIN.4
NetU?#1_1: U?#1.1(+5V) U?#2.1(+5V)
NetU?#1_3: U?#1.3(GND) U?#2.3(GND)
NetX1_TOP_RPDU_FPOUT: X1_TOP_RPDU.FPOUT(5) ; port ICE SYSTEMS-RPDU.FPOUT
NetX1_TOP_RPDU_IGNITION COIL: X1_TOP_RPDU.IGNITION_COIL(8) ; port ICE SYSTEMS-RPDU.IGNITION COIL
NetX1_TOP_RPDU_SHIFTER HES: X1_TOP_RPDU.SHIFTER_HES(4) X046.1 ; port ICE SYSTEMS-RPDU.SHIFTER HES
NetX043_1: X043.1(+5V) ; port MID VEHICLE PWR.GYRO 5V
NetX044_1: X044.1(+12V) ; port MID VEHICLE PWR.LOGGER 12V

Not connected (* = marked no-connect by the designer): 127_PIN_MABX_CONNECTOR_(see_excel_sheet) 3(Digital_In) 4(Analog_In) 5(Digital_Out); AMS_14_PIN_HEADER 1(TSMS_12V) 2(TSMS_12V) 3(RBRB_12V) 4(RBRB_12V) 5(AMS_STATUS) 6(CAN_H) 7(CAN_L) 8(CT_SENSE_1) 9(CT_SENSE_2) 10(GND) 11(GND) 12(GND) 13(GND) 14(GND); AMS_SHUTDOWN_NO_HARNESS 3; B? 2; BRAKE_LIGHT_GT150_3_PIN 2; Dash_Display 4; ESS_CONTAINER_10_PIN_MX150_PANEL_MOUNT 8(CT_SENSE_1) 9(CT_SENSE_2); ETB_CONTROLLER_MX150_20_PIN 8(CS) 13(VOUT); FPDU_NonSw_20_Pin_MX150_PWR_OUT 3(5V_SPARE_6) 11(5V_SPARE_5) 19(5V_SPARE_3) 20(5V_SPARE_4); IMD_MX150_6_PIN_PANEL MHS(5) MLS(6) NC(7); IMD_SHUTDOWN_NO_HARNESS 3; J1_Kelly_Controller_14_Pin_Aviation_Plug#1 5V SUPPLY OUT <.05A(7) BRAKE SWITCH INPUT(10) MICRO_SW THROTTLE SWITCH INPUT(8) MOTOR TEMP IN(4) RESERVED(11) REVERSING SWITCH INPUT(9); J1_Kelly_Controller_14_Pin_Aviation_Plug#2 ALARM <.2A(4) CURRENT METER (<.2A(2) GREEN LED(6) MAIN CONTACT DRIVER <2A(3) PWR OUT(1) RED LED(14) RESERVED(8); LEFT_BRB 2; MICROSQUIRT 2(CANH) 3(CANL) 4(VRIN2+) 6(FLEX_FUEL) 7(FIDLE) 8(FUEL_PUMP) 10(INJ_2) 11(IGN_2) 16(ACCEL_LED) 17(WARM_LED) 18(N/C) 30(OPTO_IN+) 31(OPTO_IN-) 35(TACH_OUT); P?#1 1; P?#2 1 2; Pi_Telem 6 7 9 10; STARTER_RELAY 3 4; STATOR_RECTIFIER 9(Rectifier_Red) 10(Rectifier_Green) 11(Rectifier_White); X1_TOP_RPDU BRAKE PRESS TRANSDUCER(12); X2_BOTTOM_RPDU ?1(13) ?2(14) ?3(16) SPARE1(18) SPARE 5V(15); X031 1(Display_+12V) 2(Automatic_Shifting) 3(Regen_agressiveness) 4(Shift_Up) 5(Shift_Down) 6(Start) 7(Force_EV_Mode) 8(Ass_Drag_Mode) 9(Engine_Starter) 10(Launch_control) 11(GND) 12(RTD_Sound_In) 13(+5V_Switches) 14(+5V_Raspberry_Pi_In) 15(+5V_Raspberry_Pi_Out) 16(Infotainment_Soft_Reset_Out) 17(IMD_LED) 18(AMS_LED) 19 20; X052 9 10 12 13 14 17 18 24 26(GND)

## Buses and harness runs
bus BrakePressure[0..1] = Engine_Tps[0..1] = ETB_Position[0...1] = PedalPot[0..2] = Vehicle_5V_Ref[0]
bus Dash [0..1] = Shift_Sense[0..1]
bus Engine_Status[0...1]
bus WheelSpeed[0..3]

## Notes on the sheet
- ALL GND'S TO BE BLK 16 AWG TO CHASSIS GROUNDING POINTS
- RULE EV5.2: No GLV and TS in same conduit or connector
- CAN LEGEND
- - CAN H is Yellow
  - CAN L is Red
  - Pink text pins are un used old pins or curently not in correct location
  - Other notes are made in orange or pink or red text boxes.
  - FPDU, DASH, and PI pinouts are currently up to date and implemented on the Car as of  March 27th 2018.
- Not Ready for Harness Do Not Pin
- FPDU
- (near FRONT_PDU_8_Pin_MX150_PWR_IN) PWR Pin 1-5
- (near FRONT_PDU_8_Pin_MX150_PWR_IN) GND Pin 6-8
- AMS/IMD NO Relays RPDU ENCLOSURE
- Rear PDU
- (near FPDU_NonSw_20_Pin_MX150_PWR_OUT) YES We do Need 2 MABX POWERS.
- Shutdown Circuit
- Relays are in the RPDU enclosure
- REAR Wheels
- Internal connections are harness design low priority. The ESS team will have to design the internal harness with extreme care!
- (near P?#1) fully contained in ess container
- (near Motor_Terminals) Motor
- Shielded Dual Insulated Cable
- (near ISO_BOARD_MX150_PANEL_2_PIN_TSAL) EV9.1.10 requires grounding of iso board
- Determine Apropriate MABX Pins
- Labels drawn without touching a wire or pin: 43 RED 16 AWG, 44 RED 16 AWG, 48 RED 16 AWG, HIGH: BLUE LOW: BROWN, HIGH: PURPLE LOW: YELLOW, WheelSpeed[0..3], WHITE SHEILDED 20 AWG
- Title
- Size:
- Date:
- File:
- C
- Number:
- Time:
- Revision:
- Sheet
- of
- (in symbol Motor) M

## Library data of the parts
20A_STATOR_FUSE 80A_GLV_MASTER_FUSE_GLVMS MAIN_INSTRUMENTATION_FUSE = Fuse 2: Fuse; Published: 8-Jun-2000; LatestRevisionDate: 17-Jul-2002; LatestRevisionNote: Re-released for DXP Platform.; PackageReference: PIN-W2/E2.8; Publisher: Altium Limited; PackageDescription: Thru-Hole; 2 Leads
? = Antenna: Generic Antenna; Published: 24-Mar-1999; LatestRevisionDate: 17-Jul-2002; LatestRevisionNote: Re-released for DXP Platform.; PackageReference: PIN1; Publisher: Altium Limited
Accelerator_Pot_1_3_Pin_Component_specific_connector Accelerator_Pot_2_3_Pin_Component_specific_connector = Pedal_Pot
AMS_SHUTDOWN_NO_HARNESS IMD_SHUTDOWN_NO_HARNESS STARTER_RELAY = Relay-SPST: Single-Pole Single-Throw Relay; Published: 24-Mar-1999; LatestRevisionDate: 17-Jul-2002; LatestRevisionNote: Re-released for DXP Platform.; PackageReference: MODULE4; Publisher: Altium Limited
B? X011 = Motor: Motor, General Kind; Published: 24-Mar-1999; LatestRevisionDate: 17-Jul-2002; LatestRevisionNote: Re-released for DXP Platform.; Publisher: Altium Limited
  B?: PackageReference: RB5-10.5; PackageDescription: Capacitor (Radial); 2 Leads
BIG_CABLE_GLANDS ESS_Container_MX_150_2_PIN_PANEL_ISO ESS_CONTAINER_MX_150_2_PUIN_PANEL_CAN ESS_Container_MX_150_2PIN_PANEL_IMD IMD_MX150_2PIN_PANEL_(_need_to_confirm_) ISO_BOARD_MX150_PANEL_2_PIN_TSAL ISO_BOARD_MX_150_2_PIN_PANEL P?#2 TS_IN = Header 2: Header, 2-Pin; LatestRevisionDate: 17-Jul-2002; LatestRevisionNote: Re-released for DXP Platform.; Publisher: Altium Limited
  ISO_BOARD_MX150_PANEL_2_PIN_TSAL: Supplier Part Number 1: 277-1721-ND
BOOTLOADER_AND_O2_GT150_2_PIN ENGINE_STATOR_GT150_2_PIN ENGINE_STATOR_MOTOR_SPADE = 2 Pin Connector: ComponentLink1Description: Manufacturer Link
BRAKE_LIGHT_GT150_3_PIN FL_SUSP_TRAVEL_GT_150_3PIN FR_SUSP_TRAVEL_GT_150_3PIN Motor_Controller_Al_Bars P?#1 P?#3 P?#4 RL_SUSP_TRAVEL_GT_150_3PIN RR_SUSP_TRAVEL_GT_150_3PIN = Header 3: Header, 3-Pin; LatestRevisionDate: 17-Jul-2002; LatestRevisionNote: Re-released for DXP Platform.; Publisher: Altium Limited
BRAKE_OVER_TRAVEL_SWITCH TSMS_MOUNTED_ON_ESS_CONTAINER = SW-SPST: Single-Pole, Single-Throw Switch; Published: 24-Mar-1999; LatestRevisionDate: 17-Jul-2002; LatestRevisionNote: Re-released for DXP Platform.; PackageReference: SPST-2; Publisher: Altium Limited; PackageDescription: Switch; 2 Leads
BRAKE_SOL_GT150_2_PIN ENGINE_FAN_GT150_2_PIN SPARK_PLUG SSOK_LAMP_LEFT SSOK_LAMP_RIGHT STARTER_RELAY_GT150_2_PIN X044 = 12V_Load
COCKPIT_BRB LEFT_BRB RIGHT_BRB = SW-PB: Switch; Published: 24-Mar-1999; LatestRevisionDate: 17-Jul-2002; LatestRevisionNote: Re-released for DXP Platform.; PackageReference: SPST-2; Publisher: Altium Limited; PackageDescription: Switch; 2 Leads
Dash_Display = 4-Pin Connector
ETB_CONTROLLER_MX150_20_PIN = ETB_Controller
ETB_GT150_6_PIN = ETB
F_BrakePressureTransducer_3_Pin_component_specific_connector R_BrakePressureTransducer_3_Pin_component_specific_connector_(_Mid_car_) = BrakePressureTransducer
FL_Wheel_speed_Sensor_3_Pin_GT_150 FR_Wheel_speed_Sensor_3_Pin_GT_150 = Wheel_Speed_Sensor
FPDU_NonSw_20_Pin_MX150_PWR_OUT = Non-Sw-RBRB
FRONT_PDU_8_Pin_MX150_PWR_IN IMD_MX150_6_PIN_PANEL = Header 8: Header, 8-Pin; LatestRevisionDate: 17-Jul-2002; LatestRevisionNote: Re-released for DXP Platform.; Publisher: Altium Limited
J1_Kelly_Controller_14_Pin_Aviation_Plug#1 J1_Kelly_Controller_14_Pin_Aviation_Plug#2 = Header 14: Header, 14-Pin; LatestRevisionDate: 17-Jul-2002; LatestRevisionNote: Re-released for DXP Platform.; Publisher: Altium Limited
Motor_Terminals = MHDR1X2: Header, 2-Pin; LatestRevisionDate: 17-Jul-2002; LatestRevisionNote: Re-released for DXP Platform.; Publisher: Altium Limited
Pi_Telem = Header 10: Header, 10-Pin; LatestRevisionDate: 17-Jul-2002; LatestRevisionNote: Re-released for DXP Platform.; Publisher: Altium Limited
R? = Res1: Resistor; Value: 4R; Published: 8-Jun-2000; LatestRevisionDate: 17-Jul-2002; LatestRevisionNote: Re-released for DXP Platform.; PackageReference: AXIAL-0.3; Publisher: Altium Limited; PackageDescription: Axial Device, Thru-Hole; 2 Leads; 0.3 in Pin Spacing
REAR_WHEEL_SPEED_SENSORS_GT150_6_PIN = Header 6: Header, 6-Pin; LatestRevisionDate: 17-Jul-2002; LatestRevisionNote: Re-released for DXP Platform.; Publisher: Altium Limited
Shifter = Shifter_Valves
SPARK_PLUG_COIL_GT150_6_PIN = 5 Pin Connector
TSAL = Lamp: Incandescent Bulb; Published: 24-Mar-1999; LatestRevisionDate: 17-Jul-2002; LatestRevisionNote: Re-released for DXP Platform.; PackageReference: PIN2; Publisher: Altium Limited
TSAL_GT150_2_PIN = Header 2X2: Header, 2-Pin, Dual row; LatestRevisionDate: 17-Jul-2002; LatestRevisionNote: Re-released for DXP Platform.; Publisher: Altium Limited
U?#1 U?#2 = Shifter_HallSensor
X1_TOP_RPDU X2_BOTTOM_RPDU = Switched 20pin
X031 = Dash_Connector
X043 = 5V LOAD
X046 = 4 Pin Connector: Capacitor; Published: 8-Jun-2000; LatestRevisionDate: 17-Jul-2002; LatestRevisionNote: Re-released for DXP Platform.; PackageReference: RAD-0.3; Publisher: Altium Limited; PackageDescription: Radial Cap, Thru-Hole; 2 Leads; 0.3 in Pin Spacing
X052 = Engine harness connector: Capacitor; Value: 100pF; Published: 8-Jun-2000; LatestRevisionDate: 17-Jul-2002; LatestRevisionNote: Re-released for DXP Platform.; PackageReference: RAD-0.3; Publisher: Altium Limited; PackageDescription: Radial Cap, Thru-Hole; 2 Leads; 0.3 in Pin Spacing